# Altium project PHOTO_CAM_100.PrjPcb
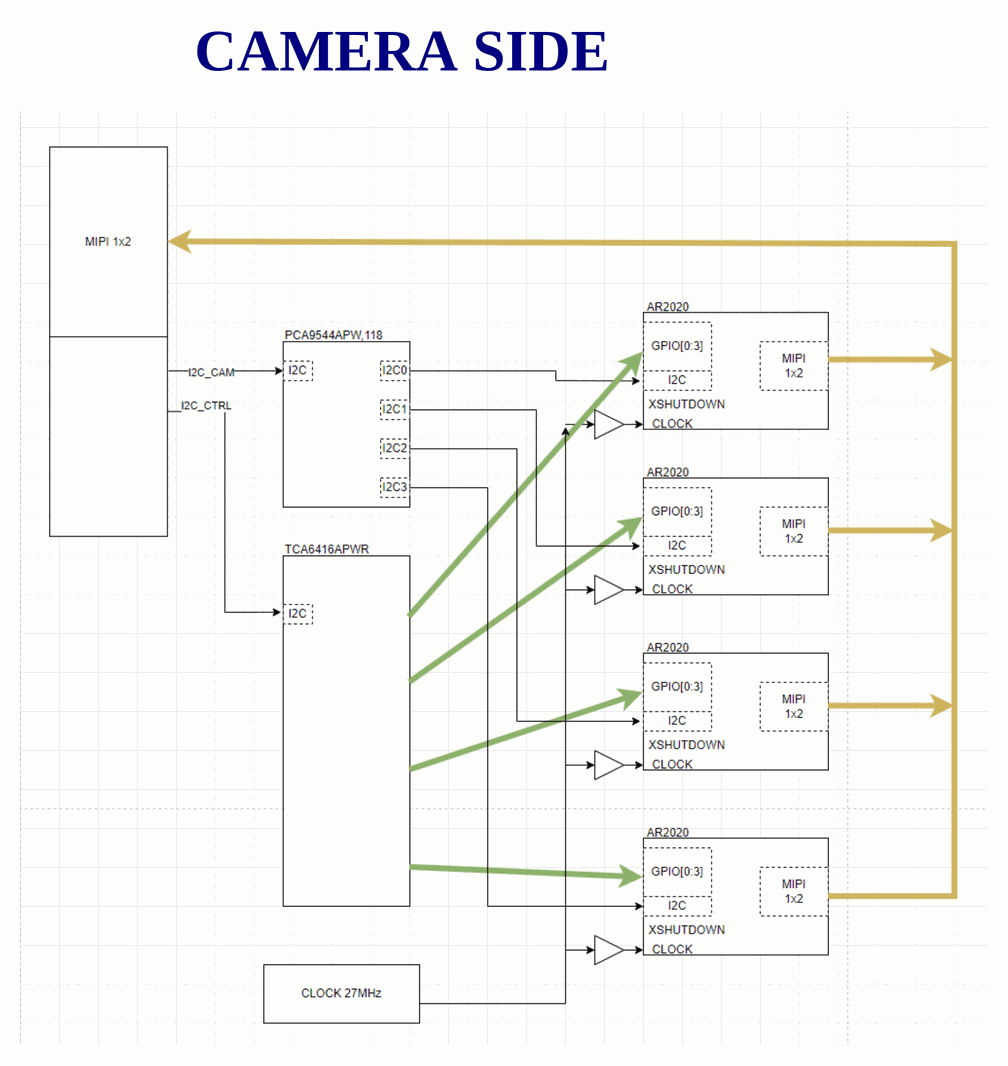
[diagram p0: BLOCK DIAGRAM.SchDoc]
SubSystem: OSA (Optical Sensor Array); Revision: 1.0.0; MasterProject: BEE-PC; DrawnBy: Cam Doan; Date: 4/25/2026; CheckedBy: Bao Bui; ApprovedBy: Vu Pham
7 sheets, 297 parts. Net scope: global (net labels, ports and power ports of the same name join across sheets).
Board file: PHOTO_CAM_100.PcbDoc
Sheets:
  BLOCK DIAGRAM.SchDoc
  PHOTO_COMMUNICATION.SchDoc
  PHOTODIODE.SchDoc
  PHOTO_POWER.SchDoc
  CAM_CONNECTOR.SchDoc
  CAM_POWER.SchDoc
  CAM_SENSOR.SchDoc

## Sheet BLOCK DIAGRAM.SchDoc
size 420 x 297 mm; SheetNumber: 1; SheetTotal: 7

### Notes on the sheet
- CAMERA SIDE
- Project:
- Sub-system:
- Design by:
- Sheet title:
- Sheet
- of
- Checked by:
- Approved by:
- Revision:
- Document No:
- Size:
- Date:
- A3

## Sheet PHOTO_COMMUNICATION.SchDoc
size 420 x 297 mm; SheetNumber: 2; SheetTotal: 7
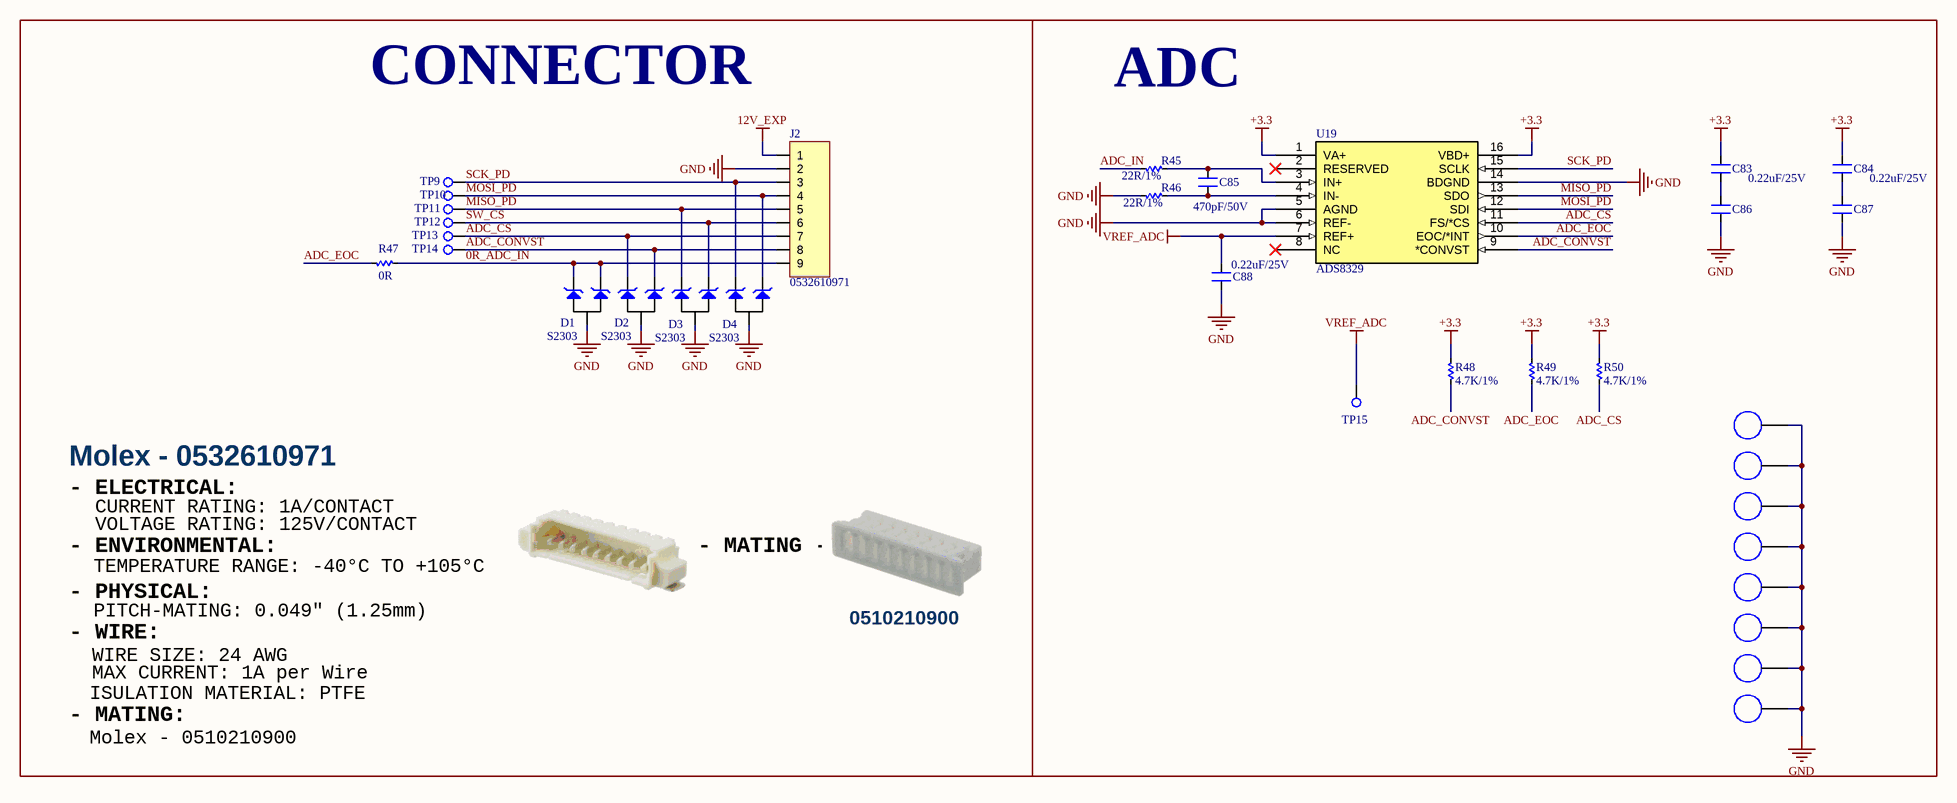
[diagram p1: PHOTO_COMMUNICATION.SchDoc]

### Parts
C83  0.22uF/25V  [CN-SMD-0603]
C84  0.22uF/25V  [CN-SMD-0603]
C85  470pF/50V  [CN-SMD-0603]
C86  0.22uF/25V  [CN-SMD-0603]  (value not drawn)
C87  0.22uF/25V  [CN-SMD-0603]  (value not drawn)
C88  0.22uF/25V  [CN-SMD-0603]
D1  S2303  [SOT23-123]
D2  S2303  [SOT23-123]
D3  S2303  [SOT23-123]
D4  S2303  [SOT23-123]
H5  HOLD  [HEX-M3_NoVia_Smaller]  (value not drawn)
H6  HOLD  [HEX-M3_NoVia_Smaller]  (value not drawn)
H7  HOLD  [HEX-M3_NoVia_Smaller]  (value not drawn)
H8  HOLD  [HEX-M3_NoVia_Smaller]  (value not drawn)
H9  HOLD  [HEX-M3_NoVia_Smaller]  (value not drawn)
H10  HOLD  [HEX-M3_NoVia_Smaller]  (value not drawn)
H11  HOLD  [HEX-M3_NoVia_Smaller]  (value not drawn)
H12  HOLD  [HEX-M3_NoVia_Smaller]  (value not drawn)
J2  0532610971  [0532610971]
R45  22R/1%  [RES-SMD-0603]
R46  22R/1%  [RES-SMD-0603]
R47  0R  [RES-SMD-0603]
R48  4.7K/1%  [RES-SMD-0603]
R49  4.7K/1%  [RES-SMD-0603]
R50  4.7K/1%  [RES-SMD-0603]
TP9  Test_Point  [TESTPOINT]  (value not drawn)
TP10  Test_Point  [TESTPOINT]  (value not drawn)
TP11  Test_Point  [TESTPOINT]  (value not drawn)
TP12  Test_Point  [TESTPOINT]  (value not drawn)
TP13  Test_Point  [TESTPOINT]  (value not drawn)
TP14  Test_Point  [TESTPOINT]  (value not drawn)
TP15  Test_Point  [TESTPOINT]  (value not drawn)
U19  ADS8329  [TSSOP16]

### Blocks framed on the sheet
CONNECTOR: D1-D4 J2 R47 TP9-TP14
ADC: C83-C88 H5-H12 R45 R46 R48-R50 TP15 U19

### Nets
12V_EXP: J2.1
+3.3: C83.2 C84.2 R48.2 R49.2 R50.2 U19.1(VA+) U19.16(VBD+)
GND: C86.1 C87.1 C88.1 D1.2 D2.2 D3.2 D4.2 H5.1 H6.1 H7.1 H8.1 H9.1 H10.1 H11.1 H12.1 J2.2 R46.2 U19.5(AGND) U19.6(REF-) U19.14(BDGND)
VREF_ADC: C88.2 TP15.1 U19.7(REF+)
0R_ADC_IN: D1.1 D1.3 J2.9 R47.1
ADC_CONVST: D2.3 J2.8 R48.1 TP14.1 U19.9(*CONVST)
ADC_CS: D2.1 J2.7 R50.1 TP13.1 U19.11(FS/*CS)
ADC_EOC: R47.2 R49.1 U19.10(EOC/*INT)
ADC_IN: R45.2
MISO_PD: D3.1 J2.5 TP11.1 U19.13(SDO)
MOSI_PD: D4.3 J2.4 TP10.1 U19.12(SDI)
SCK_PD: D4.1 J2.3 TP9.1 U19.15(SCLK)
SW_CS: D3.3 J2.6 TP12.1
NetC83_1: C83.1 C86.2
NetC84_1: C84.1 C87.2
NetC85_1: C85.1 R46.1 U19.4(IN-)
NetC85_2: C85.2 R45.1 U19.3(IN+)

Not connected (* = marked no-connect by the designer): U19 2(RESERVED)* 8(NC)*

### Notes on the sheet
- Molex - 0532610971
- - ELECTRICAL:
- CURRENT RATING: 1A/CONTACT
- VOLTAGE RATING: 125V/CONTACT
- - ENVIRONMENTAL:
- - PHYSICAL:
- TEMPERATURE RANGE: -40°C TO +105°C
- - MATING -
- - WIRE:
- WIRE SIZE: 24 AWG
- PITCH-MATING: 0.049" (1.25mm)
- 0510210900
- - MATING:
- ISULATION MATERIAL: PTFE
- MAX CURRENT: 1A per Wire
- Molex - 0510210900
- Project:
- Sub-system:
- Design by:
- Sheet title:
- Sheet
- of
- Checked by:
- Approved by:
- Revision:
- Document No:
- Size:
- Date:
- A3

### Library data of the parts
C83 C84 C86-C88 = CM: CL10B224KA8NNNC; Value: 103
C85 = CM: CL10B471KB8NNNC; Value: 103
H5-H12 = PAD_HOLD
J2 = JP9: Manufacturer: W¨¹rth Elektronik eiSos GmbH; partNo: 613009143121; ComponentLink1 Description: Manufacturer; ComponentLink2 Description: Datasheet; NoPins: 09; Created Date: 29 March 2013; ComponentLink1URL: http://www.we-online.com; ComponentLink2URL: http://katalog.we-online.de/em/datasheet/6130xx143121.pdf; Created by: Karrer Zheng
R45 R46 = Res-SMD: ERJ-3EKF22R0V; Manufacturer: Generic Components; Class: Passive; Published: 08/06/2000; Publisher: Altium Hobart Technology Centre
R47 = Res-SMD: ERJ-3GEY0R00V; Manufacturer: Generic Components; Class: Passive; Published: 08/06/2000; Publisher: Altium Hobart Technology Centre
R48-R50 = Res-SMD: ERJ-3EKF4701V; Manufacturer: Generic Components; Class: Passive; Published: 08/06/2000; Publisher: Altium Hobart Technology Centre
U19 = ADS8327: Supplier 1: Mouser; Supplier Part Number 1: 595-ADS8327IPW

## Sheet PHOTODIODE.SchDoc
size 420 x 297 mm; SheetNumber: 3; SheetTotal: 7
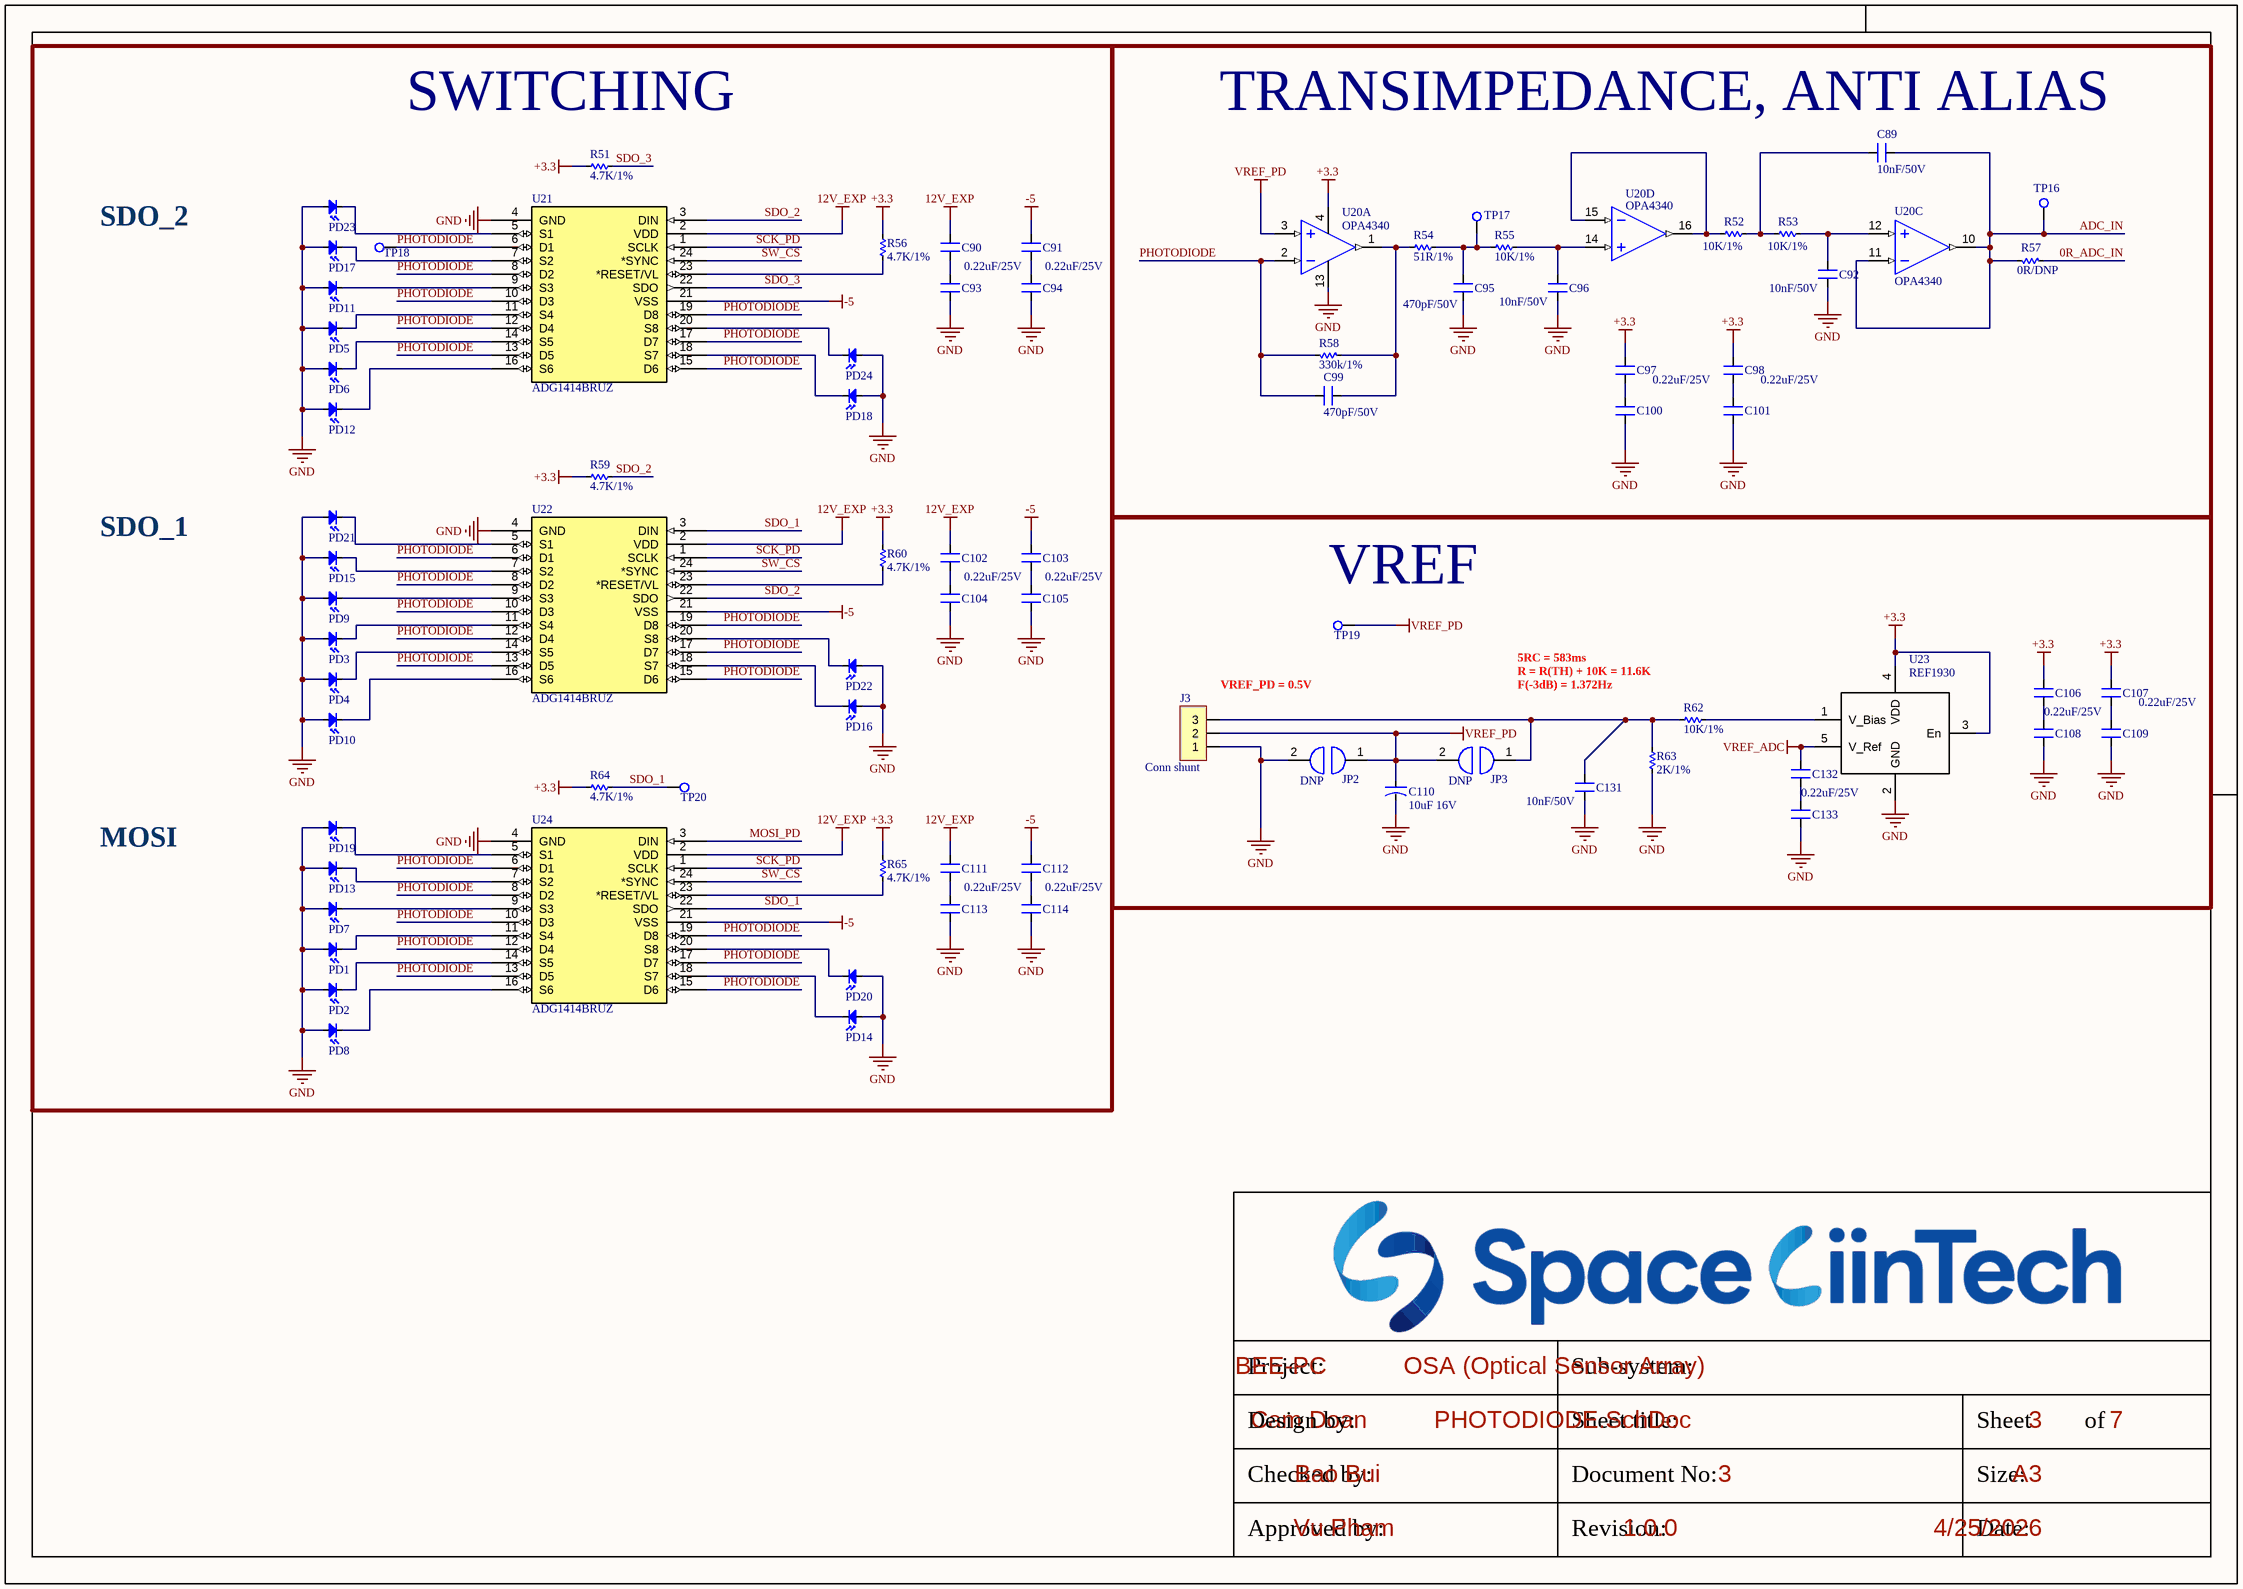
[diagram p2: PHOTODIODE.SchDoc]

### Parts
C89  10nF/50V  [CN-SMD-0603]
C90  0.22uF/25V  [CN-SMD-0603]
C91  0.22uF/25V  [CN-SMD-0603]
C92  10nF/50V  [CN-SMD-0603]
C93  0.22uF/25V  [CN-SMD-0603]  (value not drawn)
C94  0.22uF/25V  [CN-SMD-0603]  (value not drawn)
C95  470pF/50V  [CN-SMD-0603]
C96  10nF/50V  [CN-SMD-0603]
C97  0.22uF/25V  [CN-SMD-0603]
C98  0.22uF/25V  [CN-SMD-0603]
C99  470pF/50V  [CN-SMD-0603]
C100  0.22uF/25V  [CN-SMD-0603]  (value not drawn)
C101  0.22uF/25V  [CN-SMD-0603]  (value not drawn)
C102  0.22uF/25V  [CN-SMD-0603]
C103  0.22uF/25V  [CN-SMD-0603]
C104  0.22uF/25V  [CN-SMD-0603]  (value not drawn)
C105  0.22uF/25V  [CN-SMD-0603]  (value not drawn)
C106  0.22uF/25V  [CN-SMD-0603]
C107  0.22uF/25V  [CN-SMD-0603]
C108  0.22uF/25V  [CN-SMD-0603]  (value not drawn)
C109  0.22uF/25V  [CN-SMD-0603]  (value not drawn)
C110  10uF 16V  [CAP_TANT_1206]
C111  0.22uF/25V  [CN-SMD-0603]
C112  0.22uF/25V  [CN-SMD-0603]
C113  0.22uF/25V  [CN-SMD-0603]  (value not drawn)
C114  0.22uF/25V  [CN-SMD-0603]  (value not drawn)
C131  10nF/50V  [CN-SMD-0603]
C132  0.22uF/25V  [CN-SMD-0603]
C133  0.22uF/25V  [CN-SMD-0603]  (value not drawn)
J3  Conn shunt  [M50-3930342]
JP2  DNP  [JUMPER_1608]
JP3  DNP  [JUMPER_1608]
PD1  Photodiode  [VEMD5080X01]  (value not drawn)
PD2  Photodiode  [VEMD5080X01]  (value not drawn)
PD3  Photodiode  [VEMD5080X01]  (value not drawn)
PD4  Photodiode  [VEMD5080X01]  (value not drawn)
PD5  Photodiode  [VEMD5080X01]  (value not drawn)
PD6  Photodiode  [VEMD5080X01]  (value not drawn)
PD7  Photodiode  [VEMD5080X01]  (value not drawn)
PD8  Photodiode  [VEMD5080X01]  (value not drawn)
PD9  Photodiode  [VEMD5080X01]  (value not drawn)
PD10  Photodiode  [VEMD5080X01]  (value not drawn)
PD11  Photodiode  [VEMD5080X01]  (value not drawn)
PD12  Photodiode  [VEMD5080X01]  (value not drawn)
PD13  Photodiode  [VEMD5080X01]  (value not drawn)
PD14  Photodiode  [VEMD5080X01]  (value not drawn)
PD15  Photodiode  [VEMD5080X01]  (value not drawn)
PD16  Photodiode  [VEMD5080X01]  (value not drawn)
PD17  Photodiode  [VEMD5080X01]  (value not drawn)
PD18  Photodiode  [VEMD5080X01]  (value not drawn)
PD19  Photodiode  [VEMD5080X01]  (value not drawn)
PD20  Photodiode  [VEMD5080X01]  (value not drawn)
PD21  Photodiode  [VEMD5080X01]  (value not drawn)
PD22  Photodiode  [VEMD5080X01]  (value not drawn)
PD23  Photodiode  [VEMD5080X01]  (value not drawn)
PD24  Photodiode  [VEMD5080X01]  (value not drawn)
R51  4.7K/1%  [RES-SMD-0603]
R52  10K/1%  [RES-SMD-0603]
R53  10K/1%  [RES-SMD-0603]
R54  51R/1%  [RES-SMD-0603]
R55  10K/1%  [RES-SMD-0603]
R56  4.7K/1%  [RES-SMD-0603]
R57  0R/DNP  [RES-SMD-0603]
R58  330k/1%  [RES-SMD-0603]
R59  4.7K/1%  [RES-SMD-0603]
R60  4.7K/1%  [RES-SMD-0603]
R62  10K/1%  [RES-SMD-0603]
R63  2K/1%  [RES-SMD-0603]
R64  4.7K/1%  [RES-SMD-0603]
R65  4.7K/1%  [RES-SMD-0603]
TP16  Test_Point  [TESTPOINT]  (value not drawn)
TP17  Test_Point  [TESTPOINT]  (value not drawn)
TP18  Test_Point  [TESTPOINT]  (value not drawn)
TP19  Test_Point  [TESTPOINT]  (value not drawn)
TP20  Test_Point  [TESTPOINT]  (value not drawn)
U20  OPA4340  [SSOP16]  (parts A,C,D of 4)
U21  ADG1414BRUZ  [TSSOP24]
U22  ADG1414BRUZ  [TSSOP24]
U23  REF1930  [SOT23-5]
U24  ADG1414BRUZ  [TSSOP24]

### Blocks framed on the sheet
SWITCHING: C90 C91 C93 C94 C102-C105 C111-C114 PD1-PD24 R51 R56 R59 R60 R64 R65 TP18 TP20 U21 U22 U24
TRANSIMPEDANCE, ANTI ALIAS: C89 C92 C95-C101 R52-R55 R57 R58 TP16 TP17 U20
VREF: C106-C110 C131-C133 J3 JP2 JP3 R62 R63 TP19 U23

### Nets
12V_EXP: C90.2 C102.2 C111.2 U21.2(VDD) U22.2(VDD) U24.2(VDD)
+3.3: C97.2 C98.2 C106.2 C107.2 R51.2 R56.2 R59.2 R60.2 R64.2 R65.2 U20.4(+V) U23.3(En) U23.4(VDD)
-5: C91.2 C103.2 C112.2 U21.21(VSS) U22.21(VSS) U24.21(VSS)
GND: C92.1 C93.1 C94.1 C95.1 C96.1 C100.1 C101.1 C104.1 C105.1 C108.1 C109.1 C110.2 C113.1 C114.1 C131.1 C133.1 J3.1 JP2.2 PD1.1(A) PD2.1(A) PD3.1(A) PD4.1(A) PD5.1(A) PD6.1(A) PD7.1(A) PD8.1(A) PD9.1(A) PD10.1(A) PD11.1(A) PD12.1(A) PD13.1(A) PD14.1(A) PD15.1(A) PD16.1(A) PD17.1(A) PD18.1(A) PD19.1(A) PD20.1(A) PD21.1(A) PD22.1(A) PD23.1(A) PD24.1(A) R63.1 U20.13(-V) U21.4(GND) U22.4(GND) U23.2(GND) U24.4(GND)
VREF_ADC: C132.2 U23.5(V_Ref)
VREF_PD: C110.1 J3.2 JP2.1 JP3.2 TP19.1 U20.3(IN+)
0R_ADC_IN: R57.1
ADC_IN: C89.1 R57.2 TP16.1 U20.10(OUT) U20.11(IN-)
MOSI_PD: U24.3(DIN)
PHOTODIODE: C99.1 R58.1 TP18.1 U20.2(IN-) U21.6(D1) U21.8(D2) U21.10(D3) U21.12(D4) U21.13(D5) U21.15(D6) U21.17(D7) U21.19(D8) U22.6(D1) U22.8(D2) U22.10(D3) U22.12(D4) U22.13(D5) U22.15(D6) U22.17(D7) U22.19(D8) U24.6(D1) U24.8(D2) U24.10(D3) U24.12(D4) U24.13(D5) U24.15(D6) U24.17(D7) U24.19(D8)
SCK_PD: U21.1(SCLK) U22.1(SCLK) U24.1(SCLK)
SDO_1: R64.1 TP20.1 U22.3(DIN) U24.22(SDO)
SDO_2: R59.1 U21.3(DIN) U22.22(SDO)
SDO_3: R51.1 U21.22(SDO)
SW_CS: U21.24(*SYNC) U22.24(*SYNC) U24.24(*SYNC)
NetC89_2: C89.2 R52.2 R53.1
NetC90_1: C90.1 C93.2
NetC91_1: C91.1 C94.2
NetC92_2: C92.2 R53.2 U20.12(IN+)
NetC95_2: C95.2 R54.2 R55.1 TP17.1
NetC96_2: C96.2 R55.2 U20.14(IN+)
NetC97_1: C97.1 C100.2
NetC98_1: C98.1 C101.2
NetC99_2: C99.2 R54.1 R58.2 U20.1(OUT)
NetC102_1: C102.1 C104.2
NetC103_1: C103.1 C105.2
NetC106_1: C106.1 C108.2
NetC107_1: C107.1 C109.2
NetC111_1: C111.1 C113.2
NetC112_1: C112.1 C114.2
NetC131_2: C131.2 J3.3 JP3.1 R62.2 R63.2
NetC132_1: C132.1 C133.2
NetPD1_2: PD1.2(K) U24.11(S4)
NetPD2_2: PD2.2(K) U24.14(S5)
NetPD3_2: PD3.2(K) U22.11(S4)
NetPD4_2: PD4.2(K) U22.14(S5)
NetPD5_2: PD5.2(K) U21.11(S4)
NetPD6_2: PD6.2(K) U21.14(S5)
NetPD7_2: PD7.2(K) U24.9(S3)
NetPD8_2: PD8.2(K) U24.16(S6)
NetPD9_2: PD9.2(K) U22.9(S3)
NetPD10_2: PD10.2(K) U22.16(S6)
NetPD11_2: PD11.2(K) U21.9(S3)
NetPD12_2: PD12.2(K) U21.16(S6)
NetPD13_2: PD13.2(K) U24.7(S2)
NetPD14_2: PD14.2(K) U24.18(S7)
NetPD15_2: PD15.2(K) U22.7(S2)
NetPD16_2: PD16.2(K) U22.18(S7)
NetPD17_2: PD17.2(K) U21.7(S2)
NetPD18_2: PD18.2(K) U21.18(S7)
NetPD19_2: PD19.2(K) U24.5(S1)
NetPD20_2: PD20.2(K) U24.20(S8)
NetPD21_2: PD21.2(K) U22.5(S1)
NetPD22_2: PD22.2(K) U22.20(S8)
NetPD23_2: PD23.2(K) U21.5(S1)
NetPD24_2: PD24.2(K) U21.20(S8)
NetR52_1: R52.1 U20.15(IN-) U20.16(OUT)
NetR56_1: R56.1 U21.23(*RESET/VL)
NetR60_1: R60.1 U22.23(*RESET/VL)
NetR62_1: R62.1 U23.1(V_Bias)
NetR65_1: R65.1 U24.23(*RESET/VL)

### Notes on the sheet
- SDO_2
- SDO_1
- 5RC = 583ms
- (near J3) VREF_PD = 0.5V
- R = R(TH) + 10K = 11.6K
- F(-3dB) = 1.372Hz
- MOSI
- Project:
- Sub-system:
- Design by:
- Sheet title:
- Sheet
- of
- Checked by:
- Approved by:
- Revision:
- Document No:
- Size:
- Date:
- A3

### Library data of the parts
C89 C92 C96 C131 = CM: CL10B103KB8NNNC; Value: 103
C90 C91 C93 C94 C97 C98 C100-C109 C111-C114 C132 C133 = CM: CL10B224KA8NNNC; Value: 103
C95 C99 = CM: CL10B471KB8NNNC; Value: 103
C110 = CN-ALU-SMD: TAJA106K016RNJ; Published: 8-Jun-2000; LatestRevisionDate: 17-Jul-2002; LatestRevisionNote: Re-released for DXP Platform.; PackageReference: POLAR0.8; Publisher: Altium Limited
J3 = JP3: WR-PHD 2.54 mm Angled Socket Header; Manufacturer: W¨¹rth Elektronik eiSos GmbH; partNo: 613003143121; ComponentLink1 Description: Manufacturer; ComponentLink2 Description: Datasheet; NoPins: 03; Created Date: 29 March 2013; ComponentLink1URL: http://www.we-online.com; ComponentLink2URL: http://katalog.we-online.de/em/datasheet/6130xx143121.pdf; Created by: Karrer Zheng
JP2 JP3 = JUMPER
PD1-PD24 = Photodiode: VEMD5080X01
R51 R56 R59 R60 R64 R65 = Res-SMD: as R48 on sheet PHOTO_COMMUNICATION; Published: 08/06/2000; Publisher: Altium Hobart Technology Centre
R52 R53 R55 R62 = Res-SMD: ERJ-3EKF1002V; Manufacturer: Generic Components; Class: Passive; Published: 08/06/2000; Publisher: Altium Hobart Technology Centre
R54 = Res-SMD: ERJ-3EKF51R0V; Manufacturer: Generic Components; Class: Passive; Published: 08/06/2000; Publisher: Altium Hobart Technology Centre
R57 = Res-SMD: as R47 on sheet PHOTO_COMMUNICATION; Published: 08/06/2000; Publisher: Altium Hobart Technology Centre
R58 = Res-SMD: ERJ-3EKF3303V; Manufacturer: Generic Components; Class: Passive; Published: 08/06/2000; Publisher: Altium Hobart Technology Centre
R63 = Res-SMD: ERJ-3EKF2001V; Manufacturer: Generic Components; Class: Passive; Published: 08/06/2000; Publisher: Altium Hobart Technology Centre
U20 = OPA4340: OPA4340UA/2K5; Supplier 1: Mouser; Supplier Part Number 1: 595-OPA4340UA/2K5
U23 = REF19xx: REF1941AIDDCT

## Sheet PHOTO_POWER.SchDoc
size 420 x 297 mm; SheetNumber: 4; SheetTotal: 7
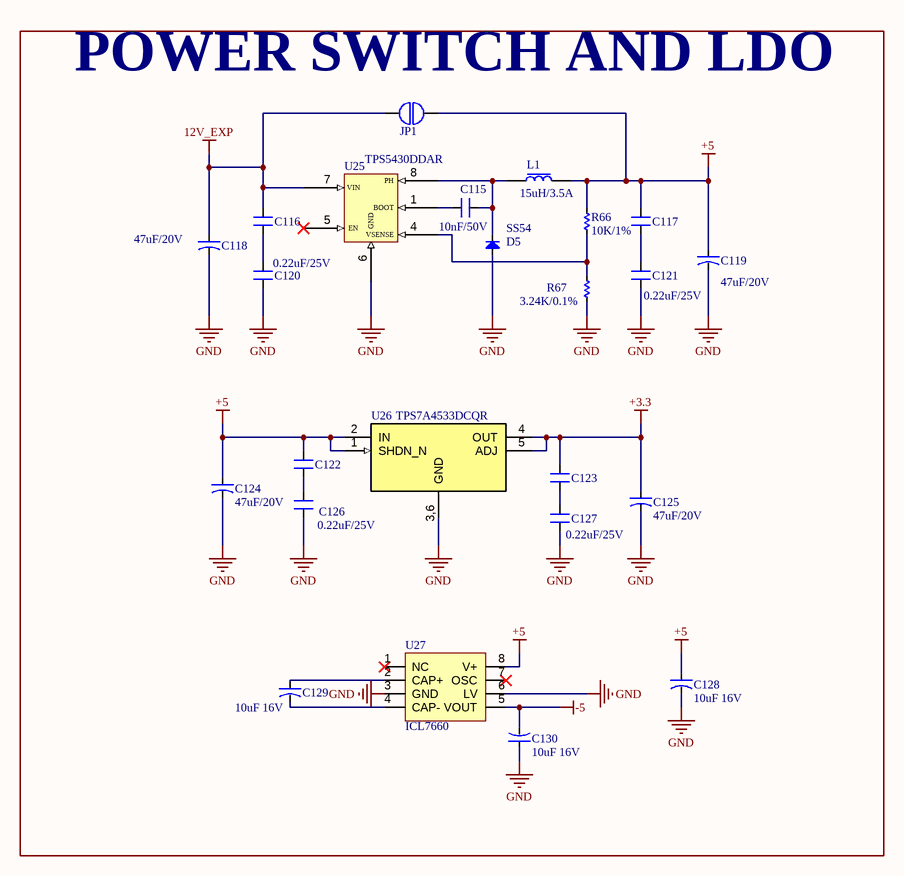
[diagram p3: PHOTO_POWER.SchDoc]

### Parts
C115  10nF/50V  [CN-SMD-0603]
C116  0.22uF/25V  [CN-SMD-0603]  (value not drawn)
C117  0.22uF/25V  [CN-SMD-0603]  (value not drawn)
C118  47uF/20V  [CAP TANT 2312]
C119  47uF/20V  [CAP TANT 2312]
C120  0.22uF/25V  [CN-SMD-0603]
C121  0.22uF/25V  [CN-SMD-0603]
C122  0.22uF/25V  [CN-SMD-0603]
C123  0.22uF/25V  [CN-SMD-0603]  (value not drawn)
C124  47uF/20V  [CAP TANT 2312]
C125  47uF/20V  [CAP TANT 2312]
C126  0.22uF/25V  [CN-SMD-0603]  (value not drawn)
C127  0.22uF/25V  [CN-SMD-0603]
C128  10uF 16V  [CAP_TANT_1206]
C129  10uF 16V  [CAP_TANT_1206]
C130  10uF 16V  [CAP_TANT_1206]
D5  SS54  [DIO-SMD-A]
JP1  JUMP2  [Jump2]  (value not drawn)
L1  15uH/3.5A  [SRP7050TA]
R66  10K/1%  [RES-SMD-0603]
R67  3.24K/0.1%  [RES-SMD-0603]
U25  TPS5430DDAR  [HSOP8]
U26  TPS7A4533DCQR  [SOT223-6]
U27  ICL7660  [SO8]

### Blocks framed on the sheet
POWER SWITCH AND LDO: C115-C130 D5 JP1 L1 R66 R67 U25-U27

### Nets
12V_EXP: C116.2 C118.1 JP1.1 U25.7(VIN)
+3.3: C123.2 C125.1 U26.4(OUT) U26.5(ADJ)
+5: C117.2 C119.1 C122.2 C124.1 C128.1 JP1.2 L1.2 R66.2 U26.1(SHDN_N) U26.2(IN) U27.8(V+)
-5: C130.2 U27.5(VOUT)
GND: C118.2 C119.2 C120.1 C121.1 C124.2 C125.2 C126.1 C127.1 C128.2 C130.1 D5.1(A) R67.1 U25.6(GND) U26.3,6(GND) U27.3(GND) U27.6(LV)
NetC115_1: C115.1 D5.2(K) L1.1 U25.8(PH)
NetC115_2: C115.2 U25.1(BOOT)
NetC116_1: C116.1 C120.2
NetC117_1: C117.1 C121.2
NetC122_1: C122.1 C126.2
NetC123_1: C123.1 C127.2
NetC129_1: C129.1 U27.2(CAP+)
NetC129_2: C129.2 U27.4(CAP-)
NetR66_1: R66.1 R67.2 U25.4(VSENSE)

Not connected (* = marked no-connect by the designer): U25 5(EN)*; U27 1(NC)* 7(OSC)*

### Notes on the sheet
- Project:
- Sub-system:
- Design by:
- Sheet title:
- Sheet
- of
- Checked by:
- Approved by:
- Revision:
- Document No:
- Size:
- Date:
- A3

### Library data of the parts
C115 = CM: CL10B103KB8NNNC; Value: 103
C116 C117 C120-C123 C126 C127 = CM: CL10B224KA8NNNC; Value: 103
C118 C119 C124 C125 = CN-ALU-SMD: TAJC476K020RNJ; Published: 8-Jun-2000; LatestRevisionDate: 17-Jul-2002; LatestRevisionNote: Re-released for DXP Platform.; PackageReference: POLAR0.8; Publisher: Altium Limited
C128-C130 = CN-ALU-SMD: TAJA106K016RNJ; Published: 8-Jun-2000; LatestRevisionDate: 17-Jul-2002; LatestRevisionNote: Re-released for DXP Platform.; PackageReference: POLAR0.8; Publisher: Altium Limited
D5 = Diode SMD: Code - JEDEC: DO-214-AB; Value: 1N5007; Published: 8-Jun-2000; Revision: July-2002: Re-released for DXP Platform.; Publisher: Altium Limited
L1 = INDUCTOR: SRP7050TA-150M
R66 = Res-SMD: as R52 on sheet PHOTODIODE; Published: 08/06/2000; Publisher: Altium Hobart Technology Centre
R67 = Res-SMD: ERA-3AEB3241V; Manufacturer: Generic Components; Class: Passive; Published: 08/06/2000; Publisher: Altium Hobart Technology Centre
U25 = TPS543X: pin to pad: 6>6+9
U27 = ICL7660: ICL7660ACBAZA-T; Creator: Nguyen Ba Bien

## Sheet CAM_CONNECTOR.SchDoc
size 420 x 297 mm; SheetNumber: 5; SheetTotal: 7
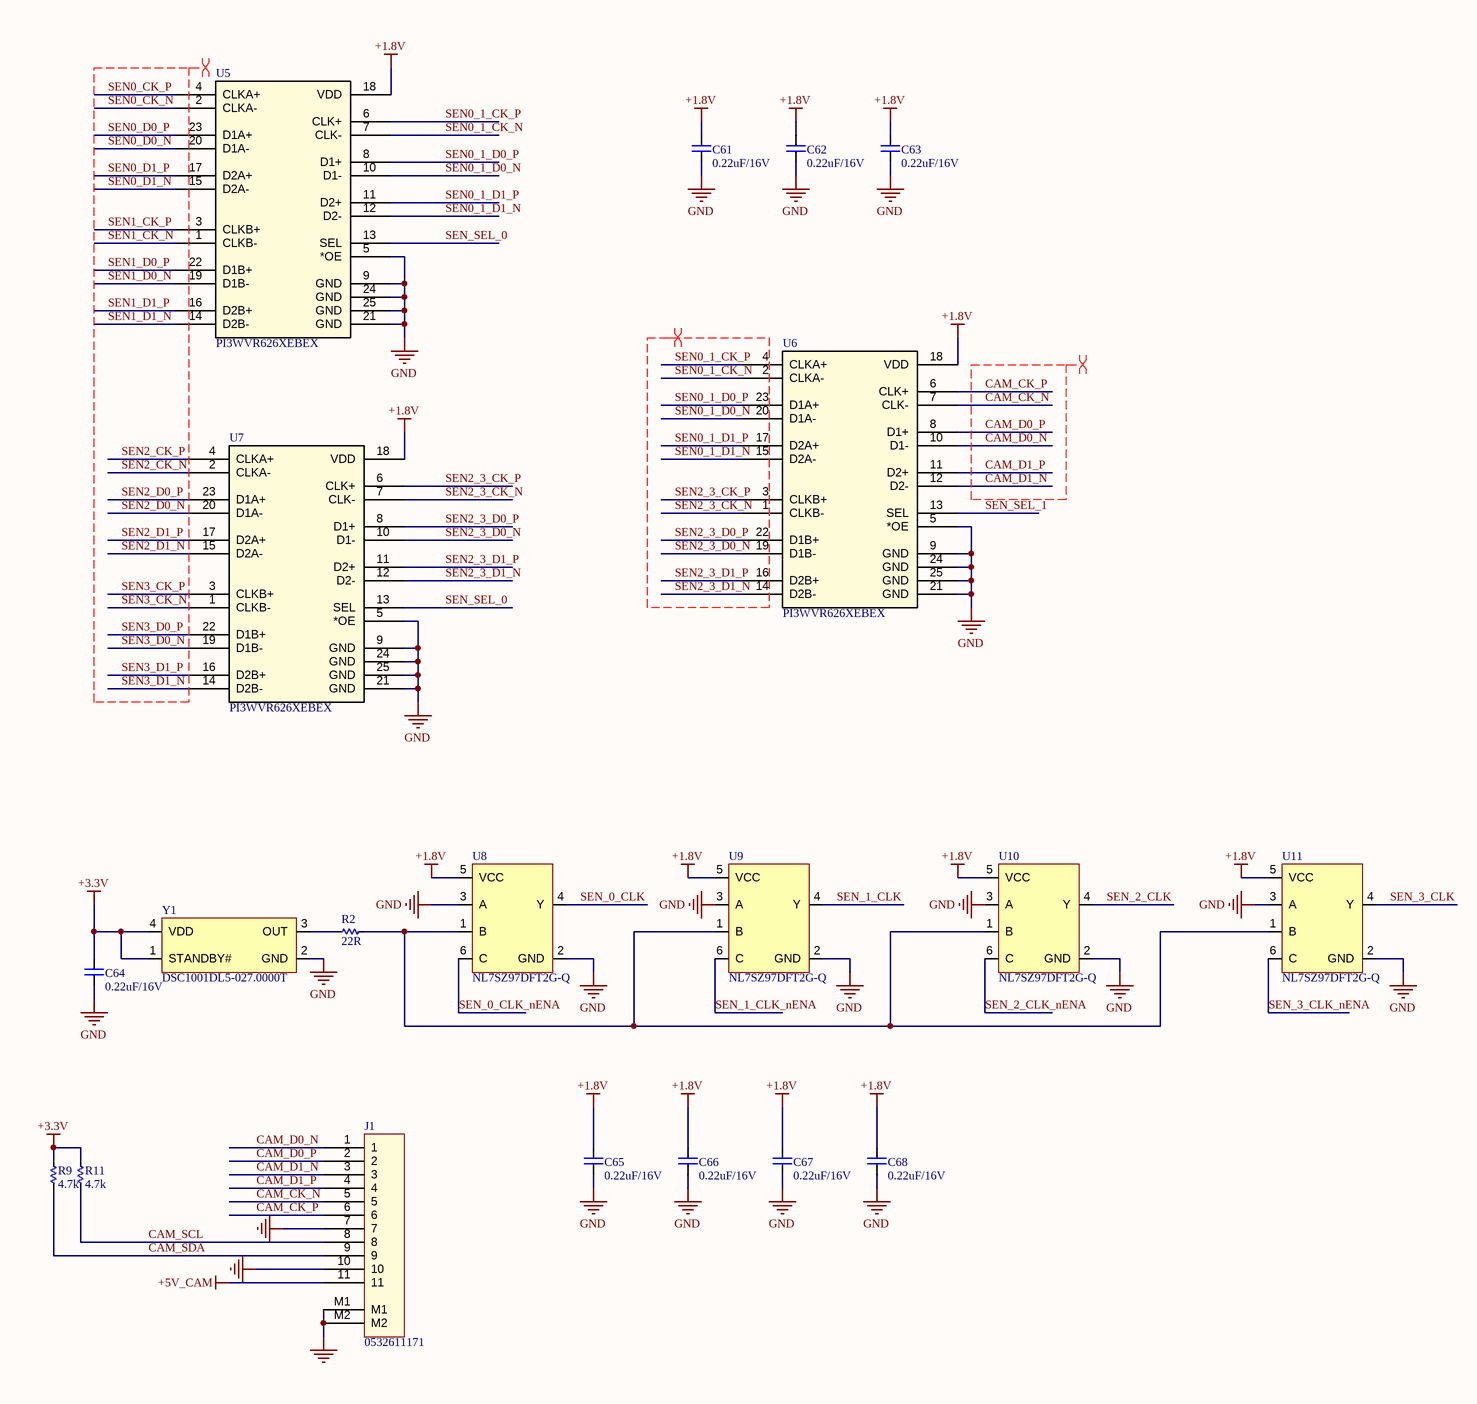
[diagram p4: CAM_CONNECTOR.SchDoc]

### Parts
C61  0.22uF/16V  [CAP_C_1005X60]
C62  0.22uF/16V  [CAP_C_1005X60]
C63  0.22uF/16V  [CAP_C_1005X60]
C64  0.22uF/16V  [CAP_C_1005X60]
C65  0.22uF/16V  [CAP_C_1005X60]
C66  0.22uF/16V  [CAP_C_1005X60]
C67  0.22uF/16V  [CAP_C_1005X60]
C68  0.22uF/16V  [CAP_C_1005X60]
J1  0532611171  [MOLEX_0532611171]
R2  22R  [RES_C_1005X40]
R9  4.7k  [RES_C_1005X40]
R11  4.7k  [RES_C_1005X40]
U5  PI3WVR626XEBEX  [PI3WVR626XEBEX_DIO_2]
U6  PI3WVR626XEBEX  [PI3WVR626XEBEX_DIO_2]
U7  PI3WVR626XEBEX  [PI3WVR626XEBEX_DIO_2]
U8  NL7SZ97DFT2G-Q  [SC-88]
U9  NL7SZ97DFT2G-Q  [SC-88]
U10  NL7SZ97DFT2G-Q  [SC-88]
U11  NL7SZ97DFT2G-Q  [SC-88]
Y1  DSC1001DL5-027.0000T  [OSCDFN250X200X89-4N]

### Nets
+1.8V: C61.2 C62.2 C63.2 C65.2 C66.2 C67.2 C68.2 U5.18(VDD) U6.18(VDD) U7.18(VDD) U8.5(VCC) U9.5(VCC) U10.5(VCC) U11.5(VCC)
+3.3V: C64.2 R9.1 R11.1 Y1.1(STANDBY#) Y1.4(VDD)
+5V_CAM: J1.11
GND: C61.1 C62.1 C63.1 C64.1 C65.1 C66.1 C67.1 C68.1 J1.7 J1.10 J1.M1 J1.M2 U5.5(*OE) U5.9(GND) U5.21(GND) U5.24(GND) U5.25(GND) U6.5(*OE) U6.9(GND) U6.21(GND) U6.24(GND) U6.25(GND) U7.5(*OE) U7.9(GND) U7.21(GND) U7.24(GND) U7.25(GND) U8.2(GND) U8.3(A) U9.2(GND) U9.3(A) U10.2(GND) U10.3(A) U11.2(GND) U11.3(A) Y1.2(GND)
CAM_CK_N: J1.5 U6.7(CLK-)
CAM_CK_P: J1.6 U6.6(CLK+)
CAM_D0_N: J1.1 U6.10(D1-)
CAM_D0_P: J1.2 U6.8(D1+)
CAM_D1_N: J1.3 U6.12(D2-)
CAM_D1_P: J1.4 U6.11(D2+)
CAM_SCL: J1.8 R11.2
CAM_SDA: J1.9 R9.2
SEN0_1_CK_N: U5.7(CLK-) U6.2(CLKA-)
SEN0_1_CK_P: U5.6(CLK+) U6.4(CLKA+)
SEN0_1_D0_N: U5.10(D1-) U6.20(D1A-)
SEN0_1_D0_P: U5.8(D1+) U6.23(D1A+)
SEN0_1_D1_N: U5.12(D2-) U6.15(D2A-)
SEN0_1_D1_P: U5.11(D2+) U6.17(D2A+)
SEN0_CK_N: U5.2(CLKA-)
SEN0_CK_P: U5.4(CLKA+)
SEN0_D0_N: U5.20(D1A-)
SEN0_D0_P: U5.23(D1A+)
SEN0_D1_N: U5.15(D2A-)
SEN0_D1_P: U5.17(D2A+)
SEN1_CK_N: U5.1(CLKB-)
SEN1_CK_P: U5.3(CLKB+)
SEN1_D0_N: U5.19(D1B-)
SEN1_D0_P: U5.22(D1B+)
SEN1_D1_N: U5.14(D2B-)
SEN1_D1_P: U5.16(D2B+)
SEN2_3_CK_N: U6.1(CLKB-) U7.7(CLK-)
SEN2_3_CK_P: U6.3(CLKB+) U7.6(CLK+)
SEN2_3_D0_N: U6.19(D1B-) U7.10(D1-)
SEN2_3_D0_P: U6.22(D1B+) U7.8(D1+)
SEN2_3_D1_N: U6.14(D2B-) U7.12(D2-)
SEN2_3_D1_P: U6.16(D2B+) U7.11(D2+)
SEN2_CK_N: U7.2(CLKA-)
SEN2_CK_P: U7.4(CLKA+)
SEN2_D0_N: U7.20(D1A-)
SEN2_D0_P: U7.23(D1A+)
SEN2_D1_N: U7.15(D2A-)
SEN2_D1_P: U7.17(D2A+)
SEN3_CK_N: U7.1(CLKB-)
SEN3_CK_P: U7.3(CLKB+)
SEN3_D0_N: U7.19(D1B-)
SEN3_D0_P: U7.22(D1B+)
SEN3_D1_N: U7.14(D2B-)
SEN3_D1_P: U7.16(D2B+)
SEN_0_CLK: U8.4(Y)
SEN_0_CLK_nENA: U8.6(C)
SEN_1_CLK: U9.4(Y)
SEN_1_CLK_nENA: U9.6(C)
SEN_2_CLK: U10.4(Y)
SEN_2_CLK_nENA: U10.6(C)
SEN_3_CLK: U11.4(Y)
SEN_3_CLK_nENA: U11.6(C)
SEN_SEL_0: U5.13(SEL) U7.13(SEL)
SEN_SEL_1: U6.13(SEL)
NetR2_1: R2.1 U8.1(B) U9.1(B) U10.1(B) U11.1(B)
NetR2_2: R2.2 Y1.3(OUT)

### Layout directives
differential pair; net class DIFF100; differential pair class DIFF100: CAM_CK_N, CAM_CK_P, CAM_D0_N, CAM_D0_P, CAM_D1_N, CAM_D1_P, SEN0_1_CK_N, SEN0_1_CK_P, SEN0_1_D0_N, SEN0_1_D0_P, SEN0_1_D1_N, SEN0_1_D1_P, SEN0_CK_N, SEN0_CK_P, SEN0_D0_N, SEN0_D0_P, SEN0_D1_N, SEN0_D1_P, SEN1_CK_N, SEN1_CK_P, SEN1_D0_N, SEN1_D0_P, SEN1_D1_N, SEN1_D1_P, SEN2_3_CK_N, SEN2_3_CK_P, SEN2_3_D0_N, SEN2_3_D0_P, SEN2_3_D1_N, SEN2_3_D1_P, SEN2_CK_N, SEN2_CK_P, SEN2_D0_N, SEN2_D0_P, SEN2_D1_N, SEN2_D1_P, SEN3_CK_N, SEN3_CK_P, SEN3_D0_N, SEN3_D0_P, SEN3_D1_N, SEN3_D1_P

### Notes on the sheet
- Project:
- Sub-system:
- Design by:
- Sheet title:
- Sheet
- of
- Checked by:
- Approved by:
- Revision:
- Document No:
- Size:
- Date:
- A3

### Library data of the parts
C61-C68 = CAP_SMD: CAP_Chip; Value: 33pF
J1 = Header 11x1_2M
R2 = RES-SMD: RES-Chip; Manufacturer: Generic Components; Class: Passive; Published: 08/06/2000; Publisher: Altium Hobart Technology Centre
R9 R11 = _RES_B_2: RES
U5-U7 = PI3WVR626XEBEX: Mfr_Name: Diodes Inc; RefDes: RefDes; Type: Type
U8-U11 = IC_FLEXLOGIC_NL7SZ97DFT2G-Q
Y1 = Y_OSC27MHz_DSC1001DL5-027.0000T

## Sheet CAM_POWER.SchDoc
size 420 x 297 mm; SheetNumber: 6; SheetTotal: 7
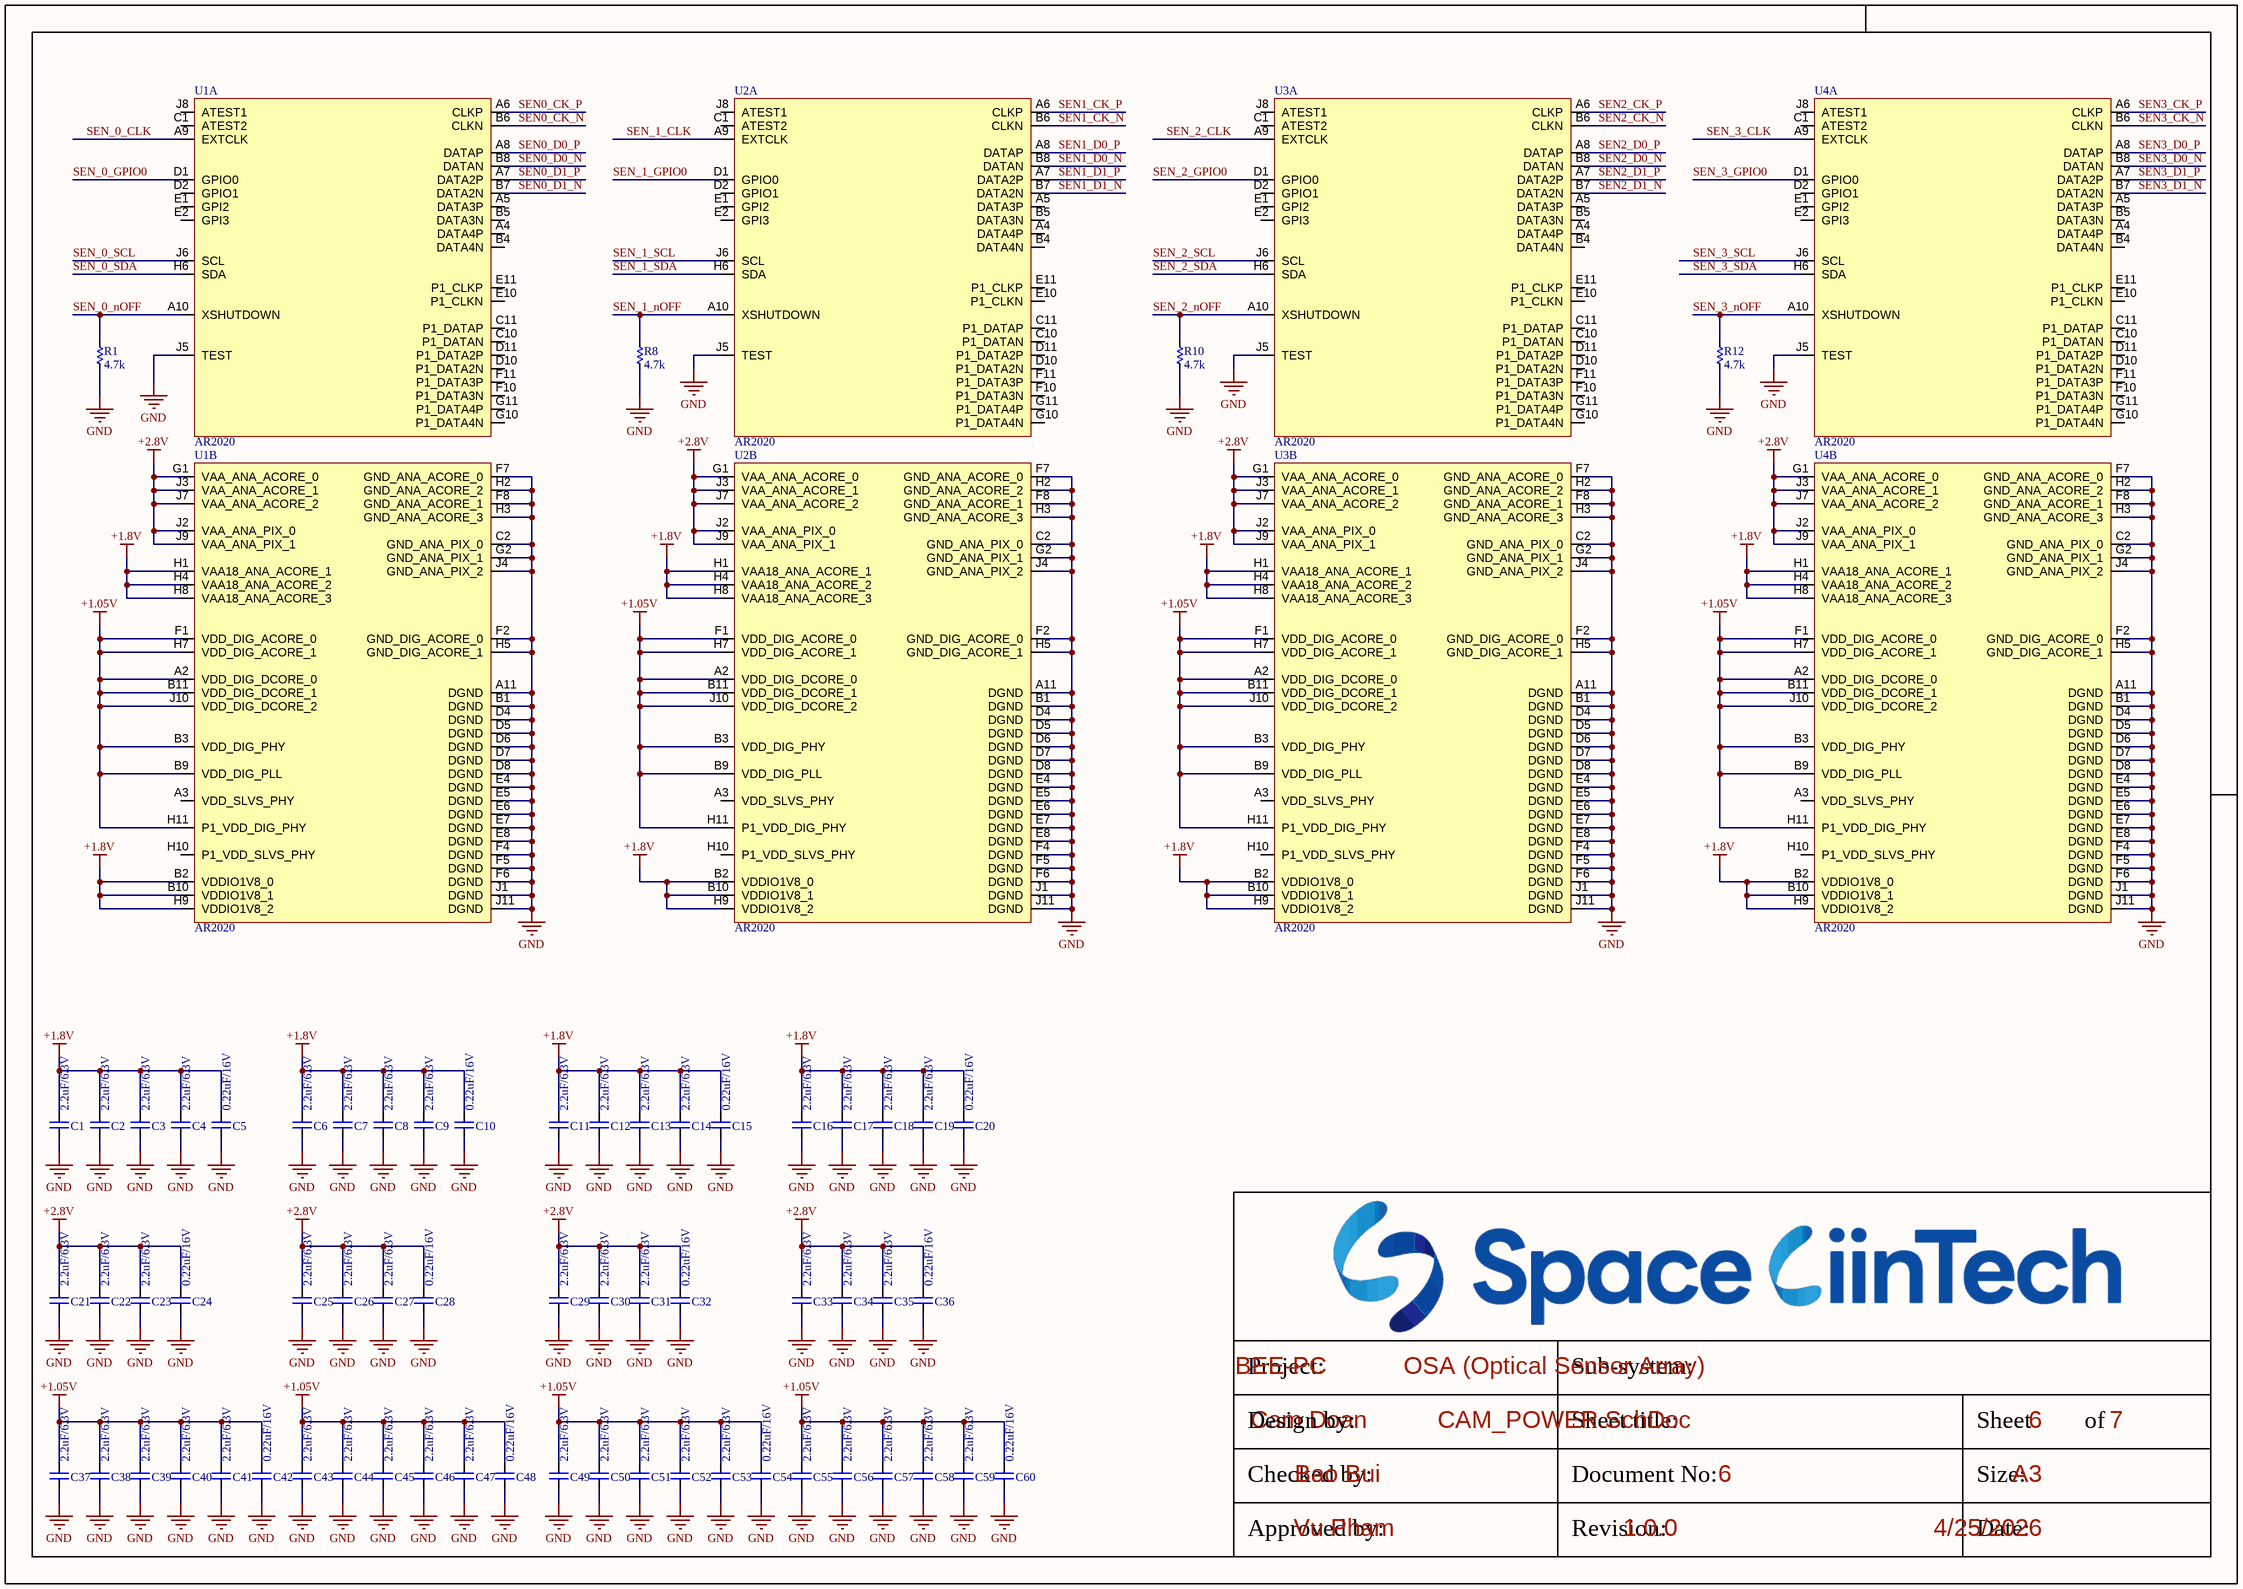
[diagram p5: CAM_POWER.SchDoc]

### Parts
C1  2.2uF/6.3V  [CAP_C_1005X60]
C2  2.2uF/6.3V  [CAP_C_1005X60]
C3  2.2uF/6.3V  [CAP_C_1005X60]
C4  2.2uF/6.3V  [CAP_C_1005X60]
C5  0.22uF/16V  [CAP_C_1005X60]
C6  2.2uF/6.3V  [CAP_C_1005X60]
C7  2.2uF/6.3V  [CAP_C_1005X60]
C8  2.2uF/6.3V  [CAP_C_1005X60]
C9  2.2uF/6.3V  [CAP_C_1005X60]
C10  0.22uF/16V  [CAP_C_1005X60]
C11  2.2uF/6.3V  [CAP_C_1005X60]
C12  2.2uF/6.3V  [CAP_C_1005X60]
C13  2.2uF/6.3V  [CAP_C_1005X60]
C14  2.2uF/6.3V  [CAP_C_1005X60]
C15  0.22uF/16V  [CAP_C_1005X60]
C16  2.2uF/6.3V  [CAP_C_1005X60]
C17  2.2uF/6.3V  [CAP_C_1005X60]
C18  2.2uF/6.3V  [CAP_C_1005X60]
C19  2.2uF/6.3V  [CAP_C_1005X60]
C20  0.22uF/16V  [CAP_C_1005X60]
C21  2.2uF/6.3V  [CAP_C_1005X60]
C22  2.2uF/6.3V  [CAP_C_1005X60]
C23  2.2uF/6.3V  [CAP_C_1005X60]
C24  0.22uF/16V  [CAP_C_1005X60]
C25  2.2uF/6.3V  [CAP_C_1005X60]
C26  2.2uF/6.3V  [CAP_C_1005X60]
C27  2.2uF/6.3V  [CAP_C_1005X60]
C28  0.22uF/16V  [CAP_C_1005X60]
C29  2.2uF/6.3V  [CAP_C_1005X60]
C30  2.2uF/6.3V  [CAP_C_1005X60]
C31  2.2uF/6.3V  [CAP_C_1005X60]
C32  0.22uF/16V  [CAP_C_1005X60]
C33  2.2uF/6.3V  [CAP_C_1005X60]
C34  2.2uF/6.3V  [CAP_C_1005X60]
C35  2.2uF/6.3V  [CAP_C_1005X60]
C36  0.22uF/16V  [CAP_C_1005X60]
C37  2.2uF/6.3V  [CAP_C_1005X60]
C38  2.2uF/6.3V  [CAP_C_1005X60]
C39  2.2uF/6.3V  [CAP_C_1005X60]
C40  2.2uF/6.3V  [CAP_C_1005X60]
C41  2.2uF/6.3V  [CAP_C_1005X60]
C42  0.22uF/16V  [CAP_C_1005X60]
C43  2.2uF/6.3V  [CAP_C_1005X60]
C44  2.2uF/6.3V  [CAP_C_1005X60]
C45  2.2uF/6.3V  [CAP_C_1005X60]
C46  2.2uF/6.3V  [CAP_C_1005X60]
C47  2.2uF/6.3V  [CAP_C_1005X60]
C48  0.22uF/16V  [CAP_C_1005X60]
C49  2.2uF/6.3V  [CAP_C_1005X60]
C50  2.2uF/6.3V  [CAP_C_1005X60]
C51  2.2uF/6.3V  [CAP_C_1005X60]
C52  2.2uF/6.3V  [CAP_C_1005X60]
C53  2.2uF/6.3V  [CAP_C_1005X60]
C54  0.22uF/16V  [CAP_C_1005X60]
C55  2.2uF/6.3V  [CAP_C_1005X60]
C56  2.2uF/6.3V  [CAP_C_1005X60]
C57  2.2uF/6.3V  [CAP_C_1005X60]
C58  2.2uF/6.3V  [CAP_C_1005X60]
C59  2.2uF/6.3V  [CAP_C_1005X60]
C60  0.22uF/16V  [CAP_C_1005X60]
R1  4.7k  [RES_C_1005X40]
R8  4.7k  [RES_C_1005X40]
R10  4.7k  [RES_C_1005X40]
R12  4.7k  [RES_C_1005X40]
U1  AR2020  [BGA78C100P11X9_1300X1050X210]  (parts A,B of 2)
U2  AR2020  [BGA78C100P11X9_1300X1050X210]  (parts A,B of 2)
U3  AR2020  [BGA78C100P11X9_1300X1050X210]  (parts A,B of 2)
U4  AR2020  [BGA78C100P11X9_1300X1050X210]  (parts A,B of 2)

### Nets
+1.05V: C37.2 C38.2 C39.2 C40.2 C41.2 C42.2 C43.2 C44.2 C45.2 C46.2 C47.2 C48.2 C49.2 C50.2 C51.2 C52.2 C53.2 C54.2 C55.2 C56.2 C57.2 C58.2 C59.2 C60.2 U1.A2(VDD_DIG_DCORE_0) U1.B3(VDD_DIG_PHY) U1.B9(VDD_DIG_PLL) U1.B11(VDD_DIG_DCORE_1) U1.F1(VDD_DIG_ACORE_0) U1.H7(VDD_DIG_ACORE_1) U1.H11(P1_VDD_DIG_PHY) U1.J10(VDD_DIG_DCORE_2) U2.A2(VDD_DIG_DCORE_0) U2.B3(VDD_DIG_PHY) U2.B9(VDD_DIG_PLL) U2.B11(VDD_DIG_DCORE_1) U2.F1(VDD_DIG_ACORE_0) U2.H7(VDD_DIG_ACORE_1) U2.H11(P1_VDD_DIG_PHY) U2.J10(VDD_DIG_DCORE_2) U3.A2(VDD_DIG_DCORE_0) U3.B3(VDD_DIG_PHY) U3.B9(VDD_DIG_PLL) U3.B11(VDD_DIG_DCORE_1) U3.F1(VDD_DIG_ACORE_0) U3.H7(VDD_DIG_ACORE_1) U3.H11(P1_VDD_DIG_PHY) U3.J10(VDD_DIG_DCORE_2) U4.A2(VDD_DIG_DCORE_0) U4.B3(VDD_DIG_PHY) U4.B9(VDD_DIG_PLL) U4.B11(VDD_DIG_DCORE_1) U4.F1(VDD_DIG_ACORE_0) U4.H7(VDD_DIG_ACORE_1) U4.H11(P1_VDD_DIG_PHY) U4.J10(VDD_DIG_DCORE_2)
+1.8V: C1.2 C2.2 C3.2 C4.2 C5.2 C6.2 C7.2 C8.2 C9.2 C10.2 C11.2 C12.2 C13.2 C14.2 C15.2 C16.2 C17.2 C18.2 C19.2 C20.2 U1.B2(VDDIO1V8_0) U1.B10(VDDIO1V8_1) U1.H1(VAA18_ANA_ACORE_1) U1.H4(VAA18_ANA_ACORE_2) U1.H8(VAA18_ANA_ACORE_3) U1.H9(VDDIO1V8_2) U2.B2(VDDIO1V8_0) U2.B10(VDDIO1V8_1) U2.H1(VAA18_ANA_ACORE_1) U2.H4(VAA18_ANA_ACORE_2) U2.H8(VAA18_ANA_ACORE_3) U2.H9(VDDIO1V8_2) U3.B2(VDDIO1V8_0) U3.B10(VDDIO1V8_1) U3.H1(VAA18_ANA_ACORE_1) U3.H4(VAA18_ANA_ACORE_2) U3.H8(VAA18_ANA_ACORE_3) U3.H9(VDDIO1V8_2) U4.B2(VDDIO1V8_0) U4.B10(VDDIO1V8_1) U4.H1(VAA18_ANA_ACORE_1) U4.H4(VAA18_ANA_ACORE_2) U4.H8(VAA18_ANA_ACORE_3) U4.H9(VDDIO1V8_2)
+2.8V: C21.2 C22.2 C23.2 C24.2 C25.2 C26.2 C27.2 C28.2 C29.2 C30.2 C31.2 C32.2 C33.2 C34.2 C35.2 C36.2 U1.G1(VAA_ANA_ACORE_0) U1.J2(VAA_ANA_PIX_0) U1.J3(VAA_ANA_ACORE_1) U1.J7(VAA_ANA_ACORE_2) U1.J9(VAA_ANA_PIX_1) U2.G1(VAA_ANA_ACORE_0) U2.J2(VAA_ANA_PIX_0) U2.J3(VAA_ANA_ACORE_1) U2.J7(VAA_ANA_ACORE_2) U2.J9(VAA_ANA_PIX_1) U3.G1(VAA_ANA_ACORE_0) U3.J2(VAA_ANA_PIX_0) U3.J3(VAA_ANA_ACORE_1) U3.J7(VAA_ANA_ACORE_2) U3.J9(VAA_ANA_PIX_1) U4.G1(VAA_ANA_ACORE_0) U4.J2(VAA_ANA_PIX_0) U4.J3(VAA_ANA_ACORE_1) U4.J7(VAA_ANA_ACORE_2) U4.J9(VAA_ANA_PIX_1)
GND: C1.1 C2.1 C3.1 C4.1 C5.1 C6.1 C7.1 C8.1 C9.1 C10.1 C11.1 C12.1 C13.1 C14.1 C15.1 C16.1 C17.1 C18.1 C19.1 C20.1 C21.1 C22.1 C23.1 C24.1 C25.1 C26.1 C27.1 C28.1 C29.1 C30.1 C31.1 C32.1 C33.1 C34.1 C35.1 C36.1 C37.1 C38.1 C39.1 C40.1 C41.1 C42.1 C43.1 C44.1 C45.1 C46.1 C47.1 C48.1 C49.1 C50.1 C51.1 C52.1 C53.1 C54.1 C55.1 C56.1 C57.1 C58.1 C59.1 C60.1 R1.2 R8.2 R10.2 R12.2 U1.A11(DGND) U1.B1(DGND) U1.C2(GND_ANA_PIX_0) U1.D4(DGND) U1.D5(DGND) U1.D6(DGND) U1.D7(DGND) U1.D8(DGND) U1.E4(DGND) U1.E5(DGND) U1.E6(DGND) U1.E7(DGND) U1.E8(DGND) U1.F2(GND_DIG_ACORE_0) U1.F4(DGND) U1.F5(DGND) U1.F6(DGND) U1.F7(GND_ANA_ACORE_0) U1.F8(GND_ANA_ACORE_1) U1.G2(GND_ANA_PIX_1) U1.H2(GND_ANA_ACORE_2) U1.H3(GND_ANA_ACORE_3) U1.H5(GND_DIG_ACORE_1) U1.J1(DGND) U1.J4(GND_ANA_PIX_2) U1.J5(TEST) U1.J11(DGND) U2.A11(DGND) U2.B1(DGND) U2.C2(GND_ANA_PIX_0) U2.D4(DGND) U2.D5(DGND) U2.D6(DGND) U2.D7(DGND) U2.D8(DGND) U2.E4(DGND) U2.E5(DGND) U2.E6(DGND) U2.E7(DGND) U2.E8(DGND) U2.F2(GND_DIG_ACORE_0) U2.F4(DGND) U2.F5(DGND) U2.F6(DGND) U2.F7(GND_ANA_ACORE_0) U2.F8(GND_ANA_ACORE_1) U2.G2(GND_ANA_PIX_1) U2.H2(GND_ANA_ACORE_2) U2.H3(GND_ANA_ACORE_3) U2.H5(GND_DIG_ACORE_1) U2.J1(DGND) U2.J4(GND_ANA_PIX_2) U2.J5(TEST) U2.J11(DGND) U3.A11(DGND) U3.B1(DGND) U3.C2(GND_ANA_PIX_0) U3.D4(DGND) U3.D5(DGND) U3.D6(DGND) U3.D7(DGND) U3.D8(DGND) U3.E4(DGND) U3.E5(DGND) U3.E6(DGND) U3.E7(DGND) U3.E8(DGND) U3.F2(GND_DIG_ACORE_0) U3.F4(DGND) U3.F5(DGND) U3.F6(DGND) U3.F7(GND_ANA_ACORE_0) U3.F8(GND_ANA_ACORE_1) U3.G2(GND_ANA_PIX_1) U3.H2(GND_ANA_ACORE_2) U3.H3(GND_ANA_ACORE_3) U3.H5(GND_DIG_ACORE_1) U3.J1(DGND) U3.J4(GND_ANA_PIX_2) U3.J5(TEST) U3.J11(DGND) U4.A11(DGND) U4.B1(DGND) U4.C2(GND_ANA_PIX_0) U4.D4(DGND) U4.D5(DGND) U4.D6(DGND) U4.D7(DGND) U4.D8(DGND) U4.E4(DGND) U4.E5(DGND) U4.E6(DGND) U4.E7(DGND) U4.E8(DGND) U4.F2(GND_DIG_ACORE_0) U4.F4(DGND) U4.F5(DGND) U4.F6(DGND) U4.F7(GND_ANA_ACORE_0) U4.F8(GND_ANA_ACORE_1) U4.G2(GND_ANA_PIX_1) U4.H2(GND_ANA_ACORE_2) U4.H3(GND_ANA_ACORE_3) U4.H5(GND_DIG_ACORE_1) U4.J1(DGND) U4.J4(GND_ANA_PIX_2) U4.J5(TEST) U4.J11(DGND)
SEN0_CK_N: U1.B6(CLKN)
SEN0_CK_P: U1.A6(CLKP)
SEN0_D0_N: U1.B8(DATAN)
SEN0_D0_P: U1.A8(DATAP)
SEN0_D1_N: U1.B7(DATA2N)
SEN0_D1_P: U1.A7(DATA2P)
SEN1_CK_N: U2.B6(CLKN)
SEN1_CK_P: U2.A6(CLKP)
SEN1_D0_N: U2.B8(DATAN)
SEN1_D0_P: U2.A8(DATAP)
SEN1_D1_N: U2.B7(DATA2N)
SEN1_D1_P: U2.A7(DATA2P)
SEN2_CK_N: U3.B6(CLKN)
SEN2_CK_P: U3.A6(CLKP)
SEN2_D0_N: U3.B8(DATAN)
SEN2_D0_P: U3.A8(DATAP)
SEN2_D1_N: U3.B7(DATA2N)
SEN2_D1_P: U3.A7(DATA2P)
SEN3_CK_N: U4.B6(CLKN)
SEN3_CK_P: U4.A6(CLKP)
SEN3_D0_N: U4.B8(DATAN)
SEN3_D0_P: U4.A8(DATAP)
SEN3_D1_N: U4.B7(DATA2N)
SEN3_D1_P: U4.A7(DATA2P)
SEN_0_CLK: U1.A9(EXTCLK)
SEN_0_GPIO0: U1.D1(GPIO0)
SEN_0_nOFF: R1.1 U1.A10(XSHUTDOWN)
SEN_0_SCL: U1.J6(SCL)
SEN_0_SDA: U1.H6(SDA)
SEN_1_CLK: U2.A9(EXTCLK)
SEN_1_GPIO0: U2.D1(GPIO0)
SEN_1_nOFF: R8.1 U2.A10(XSHUTDOWN)
SEN_1_SCL: U2.J6(SCL)
SEN_1_SDA: U2.H6(SDA)
SEN_2_CLK: U3.A9(EXTCLK)
SEN_2_GPIO0: U3.D1(GPIO0)
SEN_2_nOFF: R10.1 U3.A10(XSHUTDOWN)
SEN_2_SCL: U3.J6(SCL)
SEN_2_SDA: U3.H6(SDA)
SEN_3_CLK: U4.A9(EXTCLK)
SEN_3_GPIO0: U4.D1(GPIO0)
SEN_3_nOFF: R12.1 U4.A10(XSHUTDOWN)
SEN_3_SCL: U4.J6(SCL)
SEN_3_SDA: U4.H6(SDA)

Not connected (* = marked no-connect by the designer): U1 A3(VDD_SLVS_PHY) A4(DATA4P) A5(DATA3P) B4(DATA4N) B5(DATA3N) C1(ATEST2) C10(P1_DATAN) C11(P1_DATAP) D2(GPIO1) D10(P1_DATA2N) D11(P1_DATA2P) E1(GPI2) E2(GPI3) E10(P1_CLKN) E11(P1_CLKP) F10(P1_DATA3N) F11(P1_DATA3P) G10(P1_DATA4N) G11(P1_DATA4P) H10(P1_VDD_SLVS_PHY) J8(ATEST1); U2 A3(VDD_SLVS_PHY) A4(DATA4P) A5(DATA3P) B4(DATA4N) B5(DATA3N) C1(ATEST2) C10(P1_DATAN) C11(P1_DATAP) D2(GPIO1) D10(P1_DATA2N) D11(P1_DATA2P) E1(GPI2) E2(GPI3) E10(P1_CLKN) E11(P1_CLKP) F10(P1_DATA3N) F11(P1_DATA3P) G10(P1_DATA4N) G11(P1_DATA4P) H10(P1_VDD_SLVS_PHY) J8(ATEST1); U3 A3(VDD_SLVS_PHY) A4(DATA4P) A5(DATA3P) B4(DATA4N) B5(DATA3N) C1(ATEST2) C10(P1_DATAN) C11(P1_DATAP) D2(GPIO1) D10(P1_DATA2N) D11(P1_DATA2P) E1(GPI2) E2(GPI3) E10(P1_CLKN) E11(P1_CLKP) F10(P1_DATA3N) F11(P1_DATA3P) G10(P1_DATA4N) G11(P1_DATA4P) H10(P1_VDD_SLVS_PHY) J8(ATEST1); U4 A3(VDD_SLVS_PHY) A4(DATA4P) A5(DATA3P) B4(DATA4N) B5(DATA3N) C1(ATEST2) C10(P1_DATAN) C11(P1_DATAP) D2(GPIO1) D10(P1_DATA2N) D11(P1_DATA2P) E1(GPI2) E2(GPI3) E10(P1_CLKN) E11(P1_CLKP) F10(P1_DATA3N) F11(P1_DATA3P) G10(P1_DATA4N) G11(P1_DATA4P) H10(P1_VDD_SLVS_PHY) J8(ATEST1)

### Notes on the sheet
- Project:
- Sub-system:
- Design by:
- Sheet title:
- Sheet
- of
- Checked by:
- Approved by:
- Revision:
- Document No:
- Size:
- Date:
- A3

### Library data of the parts
C1-C60 = CAP_SMD: CAP_Chip; Value: 33pF
R1 R8 R10 R12 = RES-SMD: as R2 on sheet CAM_CONNECTOR; Published: 08/06/2000; Publisher: Altium Hobart Technology Centre

## Sheet CAM_SENSOR.SchDoc
size 420 x 297 mm; SheetNumber: 7; SheetTotal: 7
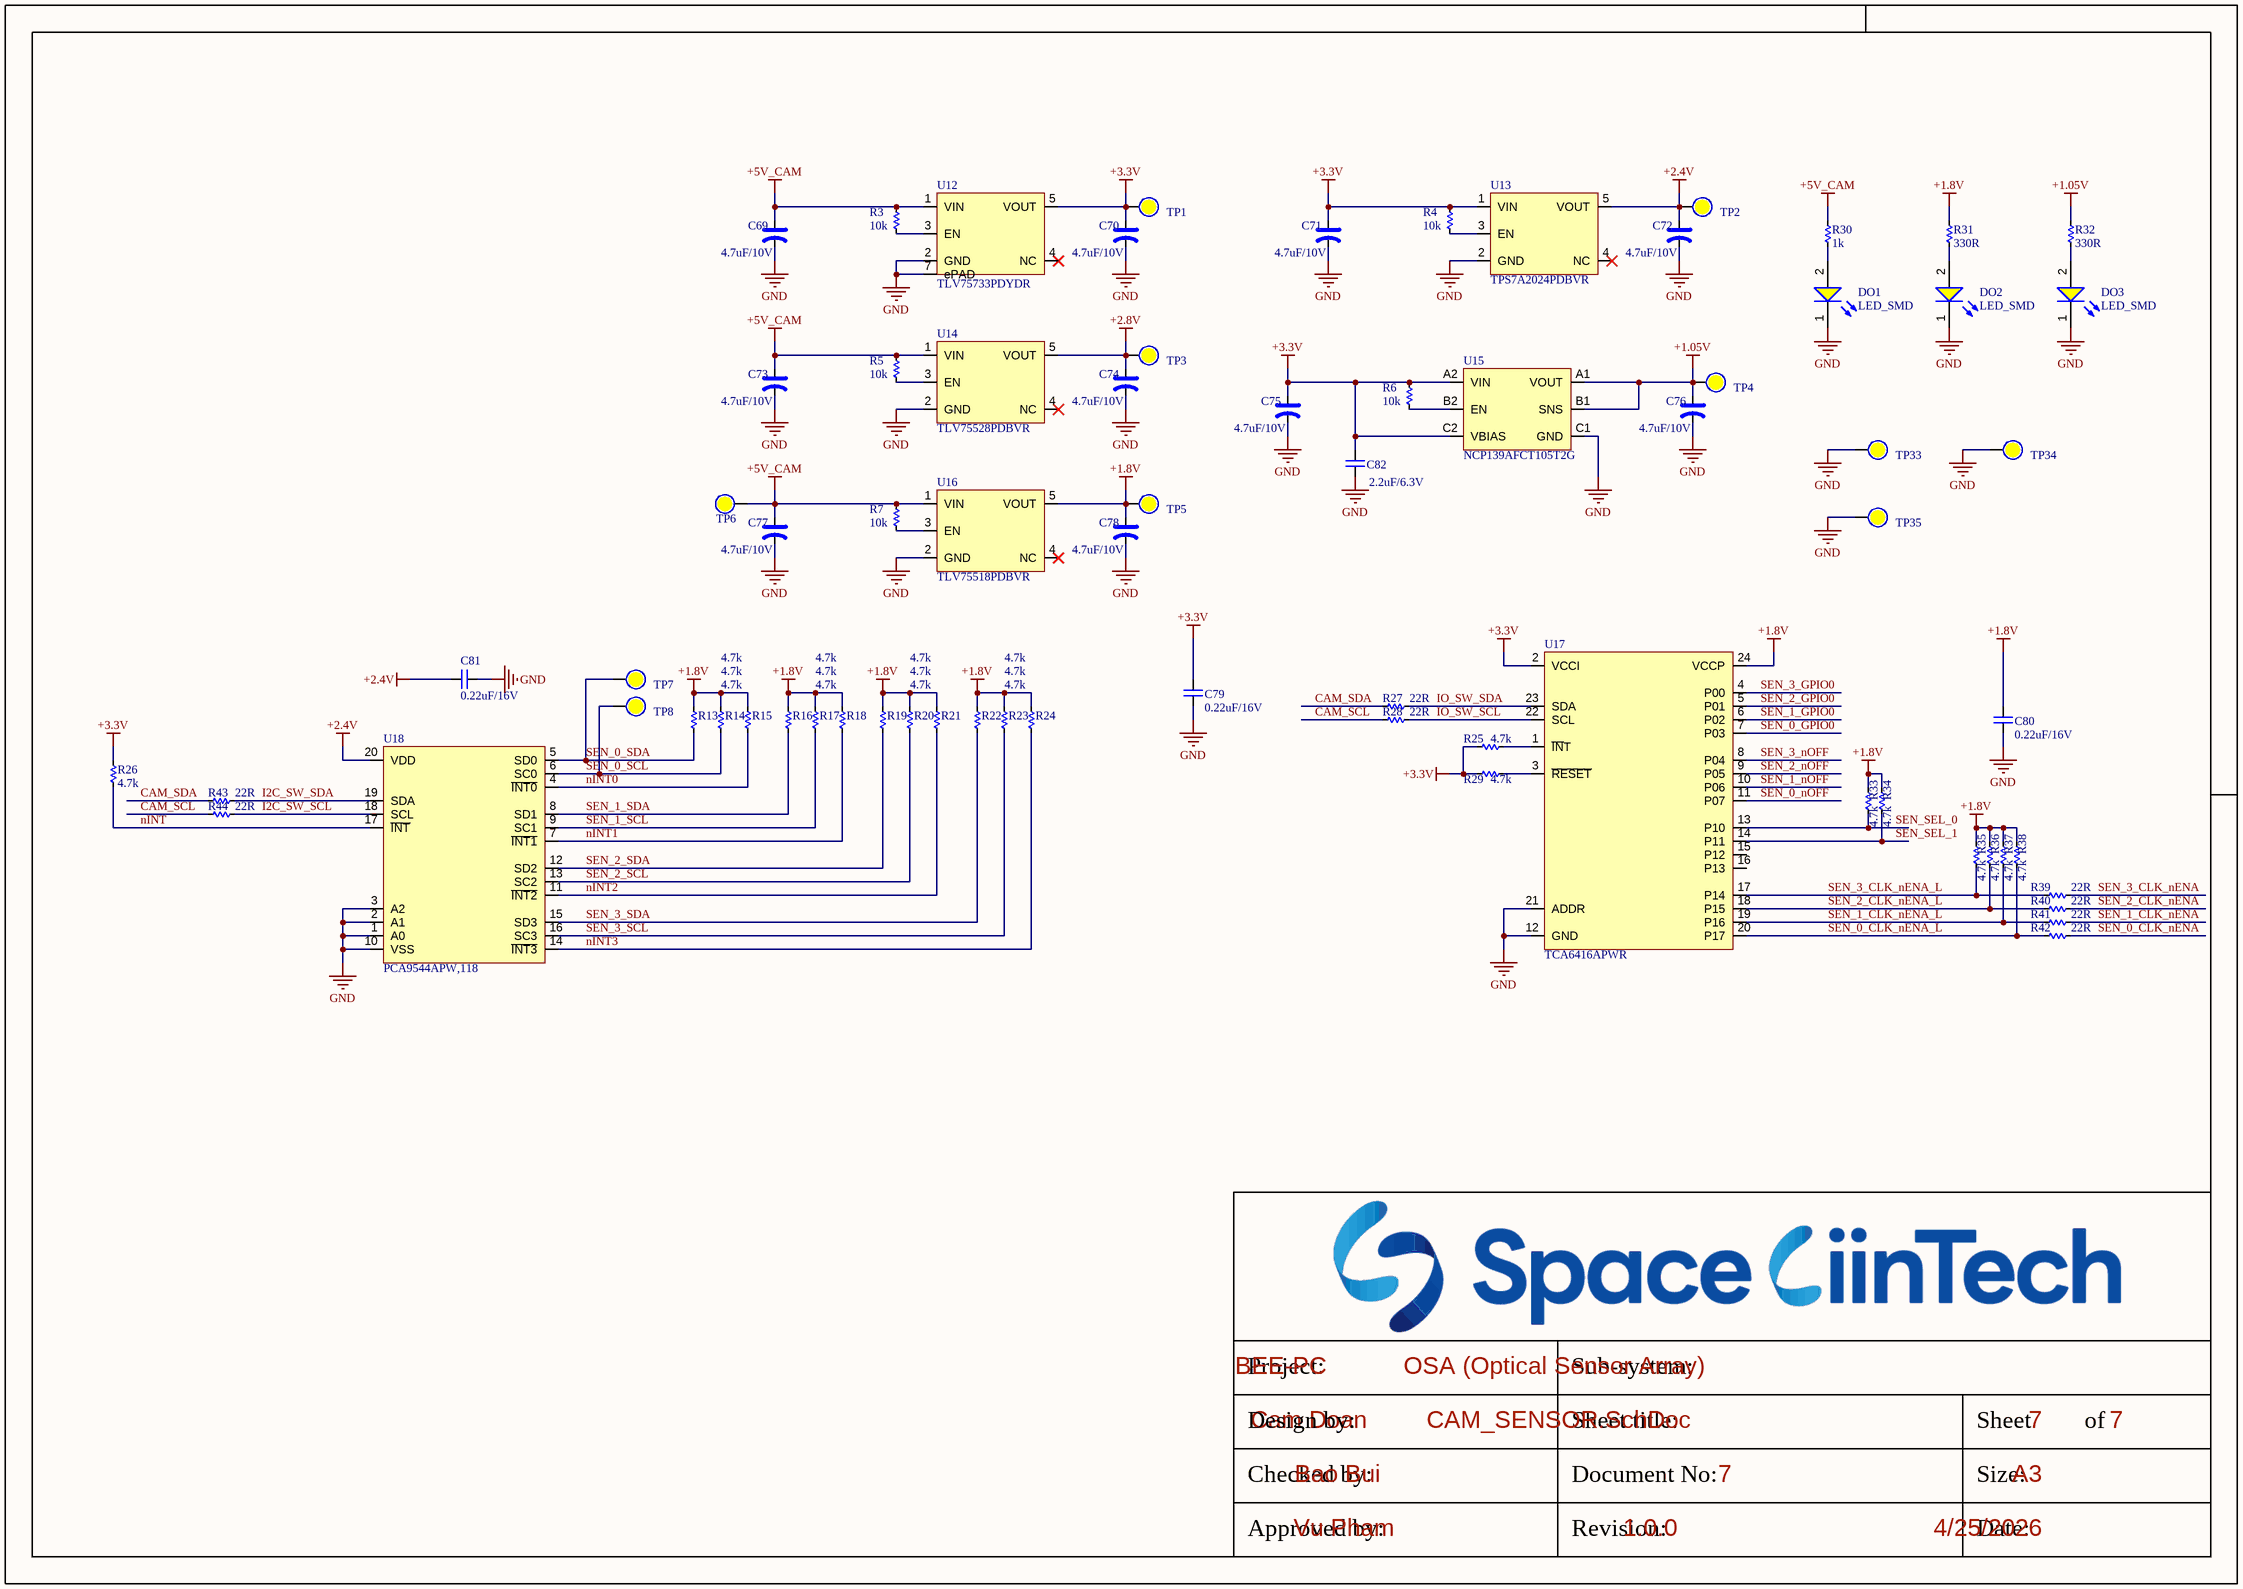
[diagram p6: CAM_SENSOR.SchDoc]

### Parts
C69  4.7uF/10V  [CAP_MP_1608X90]
C70  4.7uF/10V  [CAP_MP_1608X90]
C71  4.7uF/10V  [CAP_MP_1608X90]
C72  4.7uF/10V  [CAP_MP_1608X90]
C73  4.7uF/10V  [CAP_MP_1608X90]
C74  4.7uF/10V  [CAP_MP_1608X90]
C75  4.7uF/10V  [CAP_MP_1608X90]
C76  4.7uF/10V  [CAP_MP_1608X90]
C77  4.7uF/10V  [CAP_MP_1608X90]
C78  4.7uF/10V  [CAP_MP_1608X90]
C79  0.22uF/16V  [CAP_C_1005X60]
C80  0.22uF/16V  [CAP_C_1005X60]
C81  0.22uF/16V  [CAP_C_1005X60]
C82  2.2uF/6.3V  [CAP_C_1005X60]
DO1  LED_SMD  [LED_0603]
DO2  LED_SMD  [LED_0603]
DO3  LED_SMD  [LED_0603]
R3  10k  [RES_C_1005X40]
R4  10k  [RES_C_1005X40]
R5  10k  [RES_C_1005X40]
R6  10k  [RES_C_1005X40]
R7  10k  [RES_C_1005X40]
R13  4.7k  [RES_C_1005X40]
R14  4.7k  [RES_C_1005X40]
R15  4.7k  [RES_C_1005X40]
R16  4.7k  [RES_C_1005X40]
R17  4.7k  [RES_C_1005X40]
R18  4.7k  [RES_C_1005X40]
R19  4.7k  [RES_C_1005X40]
R20  4.7k  [RES_C_1005X40]
R21  4.7k  [RES_C_1005X40]
R22  4.7k  [RES_C_1005X40]
R23  4.7k  [RES_C_1005X40]
R24  4.7k  [RES_C_1005X40]
R25  4.7k  [RES_C_1005X40]
R26  4.7k  [RES_C_1005X40]
R27  22R  [RES_C_1005X40]
R28  22R  [RES_C_1005X40]
R29  4.7k  [RES_C_1005X40]
R30  1k  [RES_C_1005X40]
R31  330R  [RES_C_1005X40]
R32  330R  [RES_C_1005X40]
R33  4.7k  [RES_C_1005X40]
R34  4.7k  [RES_C_1005X40]
R35  4.7k  [RES_C_1005X40]
R36  4.7k  [RES_C_1005X40]
R37  4.7k  [RES_C_1005X40]
R38  4.7k  [RES_C_1005X40]
R39  22R  [RES_C_1005X40]
R40  22R  [RES_C_1005X40]
R41  22R  [RES_C_1005X40]
R42  22R  [RES_C_1005X40]
R43  22R  [RES_C_1005X40]
R44  22R  [RES_C_1005X40]
TP1  (no value)  [Testpoint_80_pin0]  (no BOM)
TP2  (no value)  [Testpoint_80_pin0]  (no BOM)
TP3  (no value)  [Testpoint_80_pin0]  (no BOM)
TP4  (no value)  [Testpoint_80_pin0]  (no BOM)
TP5  (no value)  [Testpoint_80_pin0]  (no BOM)
TP6  (no value)  [Testpoint_80_pin0]  (no BOM)
TP7  (no value)  [Testpoint_80_pin0]  (no BOM)
TP8  (no value)  [Testpoint_80_pin0]  (no BOM)
TP33  (no value)  [Testpoint_80_pin0]  (no BOM)
TP34  (no value)  [Testpoint_80_pin0]  (no BOM)
TP35  (no value)  [Testpoint_80_pin0]  (no BOM)
U12  TLV75733PDYDR  [SOT25-EPAD]
U13  TPS7A2024PDBVR  [SOT25]
U14  TLV75528PDBVR  [SOT25]
U15  NCP139AFCT105T2G  [WLCSP6]
U16  TLV75518PDBVR  [SOT25]
U17  TCA6416APWR  [SOP65P440W-24N]
U18  PCA9544APW,118  [SOP65P440W_20]

### Nets
+1.05V: C76.1 R32.1 TP4.0 U15.A1(VOUT) U15.B1(SNS)
+1.8V: C78.1 C80.2 R13.1 R14.1 R15.1 R16.1 R17.1 R18.1 R19.1 R20.1 R21.1 R22.1 R23.1 R24.1 R31.1 R33.1 R34.1 R35.1 R36.1 R37.1 R38.1 TP5.0 U16.5(VOUT) U17.24(VCCP)
+2.4V: C72.1 C81.2 TP2.0 U13.5(VOUT) U18.20(VDD)
+2.8V: C74.1 TP3.0 U14.5(VOUT)
+3.3V: C70.1 C71.1 C75.1 C79.2 C82.2 R4.2 R6.2 R25.1 R26.1 R29.1 TP1.0 U12.5(VOUT) U13.1(VIN) U15.A2(VIN) U15.C2(VBIAS) U17.2(VCCI)
+5V_CAM: C69.1 C73.1 C77.1 R3.2 R5.2 R7.2 R30.1 TP6.0 U12.1(VIN) U14.1(VIN) U16.1(VIN)
GND: C69.2 C70.2 C71.2 C72.2 C73.2 C74.2 C75.2 C76.2 C77.2 C78.2 C79.1 C80.1 C81.1 C82.1 DO1.1(K) DO2.1(K) DO3.1(K) TP33.0 TP34.0 TP35.0 U12.2(GND) U12.7(ePAD) U13.2(GND) U14.2(GND) U15.C1(GND) U16.2(GND) U17.12(GND) U17.21(ADDR) U18.1(A0) U18.2(A1) U18.3(A2) U18.10(VSS)
CAM_SCL: R28.2 R44.2
CAM_SDA: R27.2 R43.2
I2C_SW_SCL: R44.1 U18.18(SCL)
I2C_SW_SDA: R43.1 U18.19(SDA)
IO_SW_SCL: R28.1 U17.22(SCL)
IO_SW_SDA: R27.1 U17.23(SDA)
nINT: R26.2 U18.17(~{INT})
nINT0: R15.2 U18.4(~{INT0})
nINT1: R18.2 U18.7(~{INT1})
nINT2: R21.2 U18.11(~{INT2})
nINT3: R24.2 U18.14(~{INT3})
SEN_0_CLK_nENA: R42.1
SEN_0_CLK_nENA_L: R38.2 R42.2 U17.20(P17)
SEN_0_GPIO0: U17.7(P03)
SEN_0_nOFF: U17.11(P07)
SEN_0_SCL: R14.2 TP8.0 U18.6(SC0)
SEN_0_SDA: R13.2 TP7.0 U18.5(SD0)
SEN_1_CLK_nENA: R41.1
SEN_1_CLK_nENA_L: R37.2 R41.2 U17.19(P16)
SEN_1_GPIO0: U17.6(P02)
SEN_1_nOFF: U17.10(P06)
SEN_1_SCL: R17.2 U18.9(SC1)
SEN_1_SDA: R16.2 U18.8(SD1)
SEN_2_CLK_nENA: R40.1
SEN_2_CLK_nENA_L: R36.2 R40.2 U17.18(P15)
SEN_2_GPIO0: U17.5(P01)
SEN_2_nOFF: U17.9(P05)
SEN_2_SCL: R20.2 U18.13(SC2)
SEN_2_SDA: R19.2 U18.12(SD2)
SEN_3_CLK_nENA: R39.1
SEN_3_CLK_nENA_L: R35.2 R39.2 U17.17(P14)
SEN_3_GPIO0: U17.4(P00)
SEN_3_nOFF: U17.8(P04)
SEN_3_SCL: R23.2 U18.16(SC3)
SEN_3_SDA: R22.2 U18.15(SD3)
SEN_SEL_0: R33.2 U17.13(P10)
SEN_SEL_1: R34.2 U17.14(P11)
NetDO1_2: DO1.2(A) R30.2
NetDO2_2: DO2.2(A) R31.2
NetDO3_2: DO3.2(A) R32.2
NetR3_1: R3.1 U12.3(EN)
NetR4_1: R4.1 U13.3(EN)
NetR5_1: R5.1 U14.3(EN)
NetR6_1: R6.1 U15.B2(EN)
NetR7_1: R7.1 U16.3(EN)
NetR25_2: R25.2 U17.1(~{IN}T)
NetR29_2: R29.2 U17.3(~{RESET})

Not connected (* = marked no-connect by the designer): U12 4(NC)*; U13 4(NC)*; U14 4(NC)*; U16 4(NC)*; U17 15(P12) 16(P13)

### Notes on the sheet
- Project:
- Sub-system:
- Design by:
- Sheet title:
- Sheet
- of
- Checked by:
- Approved by:
- Revision:
- Document No:
- Size:
- Date:
- A3

### Library data of the parts
C69-C78 = CAP_TH: CAP_Polarization; Published: 8-Jun-2000; LatestRevisionDate: 17-Jul-2002; LatestRevisionNote: Re-released for DXP Platform.; PackageReference: POLAR0.8; Publisher: Altium Limited
C79-C82 = CAP_SMD: CAP_Chip; Value: 33pF
R3-R7 R13-R44 = RES-SMD: as R2 on sheet CAM_CONNECTOR; Published: 08/06/2000; Publisher: Altium Hobart Technology Centre
TP1-TP8 TP33-TP35 = Test Point: Solder: NF
U12 = IC_POWER_TLV75733PDYDR
U13 U14 U16 = IC_POWER_AP7347DQ
U15 = IC_POWER_NCP139AFCT105T2G
U17 = IC_I2Cto16IO_TCA6416APWR
U18 = IC_I2CSW1to4_PCA9544APW,118

## Nets that join several sheets
12V_EXP: PHOTO_COMMUNICATION (J2.1), PHOTODIODE (6 pins), PHOTO_POWER (C116.2 C118.1 JP1.1 U25.7)
+1.05V: CAM_POWER (56 pins), CAM_SENSOR (5 pins)
+1.8V: CAM_CONNECTOR (14 pins), CAM_POWER (44 pins), CAM_SENSOR (24 pins)
+2.8V: CAM_POWER (36 pins), CAM_SENSOR (C74.1 TP3.0 U14.5)
+3.3: PHOTO_COMMUNICATION (7 pins), PHOTODIODE (13 pins), PHOTO_POWER (C123.2 C125.1 U26.4 U26.5)
+3.3V: CAM_CONNECTOR (5 pins), CAM_SENSOR (16 pins)
+5V_CAM: CAM_CONNECTOR (J1.11), CAM_SENSOR (11 pins)
-5: PHOTODIODE (6 pins), PHOTO_POWER (C130.2 U27.5)
GND: PHOTO_COMMUNICATION (20 pins), PHOTODIODE (48 pins), PHOTO_POWER (16 pins), CAM_CONNECTOR (36 pins), CAM_POWER (172 pins), CAM_SENSOR (32 pins)
VREF_ADC: PHOTO_COMMUNICATION (C88.2 TP15.1 U19.7), PHOTODIODE (C132.2 U23.5)
0R_ADC_IN: PHOTO_COMMUNICATION (D1.1 D1.3 J2.9 R47.1), PHOTODIODE (R57.1)
ADC_IN: PHOTO_COMMUNICATION (R45.2), PHOTODIODE (5 pins)
CAM_SCL: CAM_CONNECTOR (J1.8 R11.2), CAM_SENSOR (R28.2 R44.2)
CAM_SDA: CAM_CONNECTOR (J1.9 R9.2), CAM_SENSOR (R27.2 R43.2)
MOSI_PD: PHOTO_COMMUNICATION (D4.3 J2.4 TP10.1 U19.12), PHOTODIODE (U24.3)
SCK_PD: PHOTO_COMMUNICATION (D4.1 J2.3 TP9.1 U19.15), PHOTODIODE (U21.1 U22.1 U24.1)
SEN0_CK_N: CAM_CONNECTOR (U5.2), CAM_POWER (U1.B6)
SEN0_CK_P: CAM_CONNECTOR (U5.4), CAM_POWER (U1.A6)
SEN0_D0_N: CAM_CONNECTOR (U5.20), CAM_POWER (U1.B8)
SEN0_D0_P: CAM_CONNECTOR (U5.23), CAM_POWER (U1.A8)
SEN0_D1_N: CAM_CONNECTOR (U5.15), CAM_POWER (U1.B7)
SEN0_D1_P: CAM_CONNECTOR (U5.17), CAM_POWER (U1.A7)
SEN1_CK_N: CAM_CONNECTOR (U5.1), CAM_POWER (U2.B6)
SEN1_CK_P: CAM_CONNECTOR (U5.3), CAM_POWER (U2.A6)
SEN1_D0_N: CAM_CONNECTOR (U5.19), CAM_POWER (U2.B8)
SEN1_D0_P: CAM_CONNECTOR (U5.22), CAM_POWER (U2.A8)
SEN1_D1_N: CAM_CONNECTOR (U5.14), CAM_POWER (U2.B7)
SEN1_D1_P: CAM_CONNECTOR (U5.16), CAM_POWER (U2.A7)
SEN2_CK_N: CAM_CONNECTOR (U7.2), CAM_POWER (U3.B6)
SEN2_CK_P: CAM_CONNECTOR (U7.4), CAM_POWER (U3.A6)
SEN2_D0_N: CAM_CONNECTOR (U7.20), CAM_POWER (U3.B8)
SEN2_D0_P: CAM_CONNECTOR (U7.23), CAM_POWER (U3.A8)
SEN2_D1_N: CAM_CONNECTOR (U7.15), CAM_POWER (U3.B7)
SEN2_D1_P: CAM_CONNECTOR (U7.17), CAM_POWER (U3.A7)
SEN3_CK_N: CAM_CONNECTOR (U7.1), CAM_POWER (U4.B6)
SEN3_CK_P: CAM_CONNECTOR (U7.3), CAM_POWER (U4.A6)
SEN3_D0_N: CAM_CONNECTOR (U7.19), CAM_POWER (U4.B8)
SEN3_D0_P: CAM_CONNECTOR (U7.22), CAM_POWER (U4.A8)
SEN3_D1_N: CAM_CONNECTOR (U7.14), CAM_POWER (U4.B7)
SEN3_D1_P: CAM_CONNECTOR (U7.16), CAM_POWER (U4.A7)
SEN_0_CLK: CAM_CONNECTOR (U8.4), CAM_POWER (U1.A9)
SEN_0_CLK_nENA: CAM_CONNECTOR (U8.6), CAM_SENSOR (R42.1)
SEN_0_GPIO0: CAM_POWER (U1.D1), CAM_SENSOR (U17.7)
SEN_0_nOFF: CAM_POWER (R1.1 U1.A10), CAM_SENSOR (U17.11)
SEN_0_SCL: CAM_POWER (U1.J6), CAM_SENSOR (R14.2 TP8.0 U18.6)
SEN_0_SDA: CAM_POWER (U1.H6), CAM_SENSOR (R13.2 TP7.0 U18.5)
SEN_1_CLK: CAM_CONNECTOR (U9.4), CAM_POWER (U2.A9)
SEN_1_CLK_nENA: CAM_CONNECTOR (U9.6), CAM_SENSOR (R41.1)
SEN_1_GPIO0: CAM_POWER (U2.D1), CAM_SENSOR (U17.6)
SEN_1_nOFF: CAM_POWER (R8.1 U2.A10), CAM_SENSOR (U17.10)
SEN_1_SCL: CAM_POWER (U2.J6), CAM_SENSOR (R17.2 U18.9)
SEN_1_SDA: CAM_POWER (U2.H6), CAM_SENSOR (R16.2 U18.8)
SEN_2_CLK: CAM_CONNECTOR (U10.4), CAM_POWER (U3.A9)
SEN_2_CLK_nENA: CAM_CONNECTOR (U10.6), CAM_SENSOR (R40.1)
SEN_2_GPIO0: CAM_POWER (U3.D1), CAM_SENSOR (U17.5)
SEN_2_nOFF: CAM_POWER (R10.1 U3.A10), CAM_SENSOR (U17.9)
SEN_2_SCL: CAM_POWER (U3.J6), CAM_SENSOR (R20.2 U18.13)
SEN_2_SDA: CAM_POWER (U3.H6), CAM_SENSOR (R19.2 U18.12)
SEN_3_CLK: CAM_CONNECTOR (U11.4), CAM_POWER (U4.A9)
SEN_3_CLK_nENA: CAM_CONNECTOR (U11.6), CAM_SENSOR (R39.1)
SEN_3_GPIO0: CAM_POWER (U4.D1), CAM_SENSOR (U17.4)
SEN_3_nOFF: CAM_POWER (R12.1 U4.A10), CAM_SENSOR (U17.8)
SEN_3_SCL: CAM_POWER (U4.J6), CAM_SENSOR (R23.2 U18.16)
SEN_3_SDA: CAM_POWER (U4.H6), CAM_SENSOR (R22.2 U18.15)
SEN_SEL_0: CAM_CONNECTOR (U5.13 U7.13), CAM_SENSOR (R33.2 U17.13)
SEN_SEL_1: CAM_CONNECTOR (U6.13), CAM_SENSOR (R34.2 U17.14)
SW_CS: PHOTO_COMMUNICATION (D3.3 J2.6 TP12.1), PHOTODIODE (U21.24 U22.24 U24.24)